# EAGLE board RFBoard (EAGLE 9.3.1), part 1 of 2
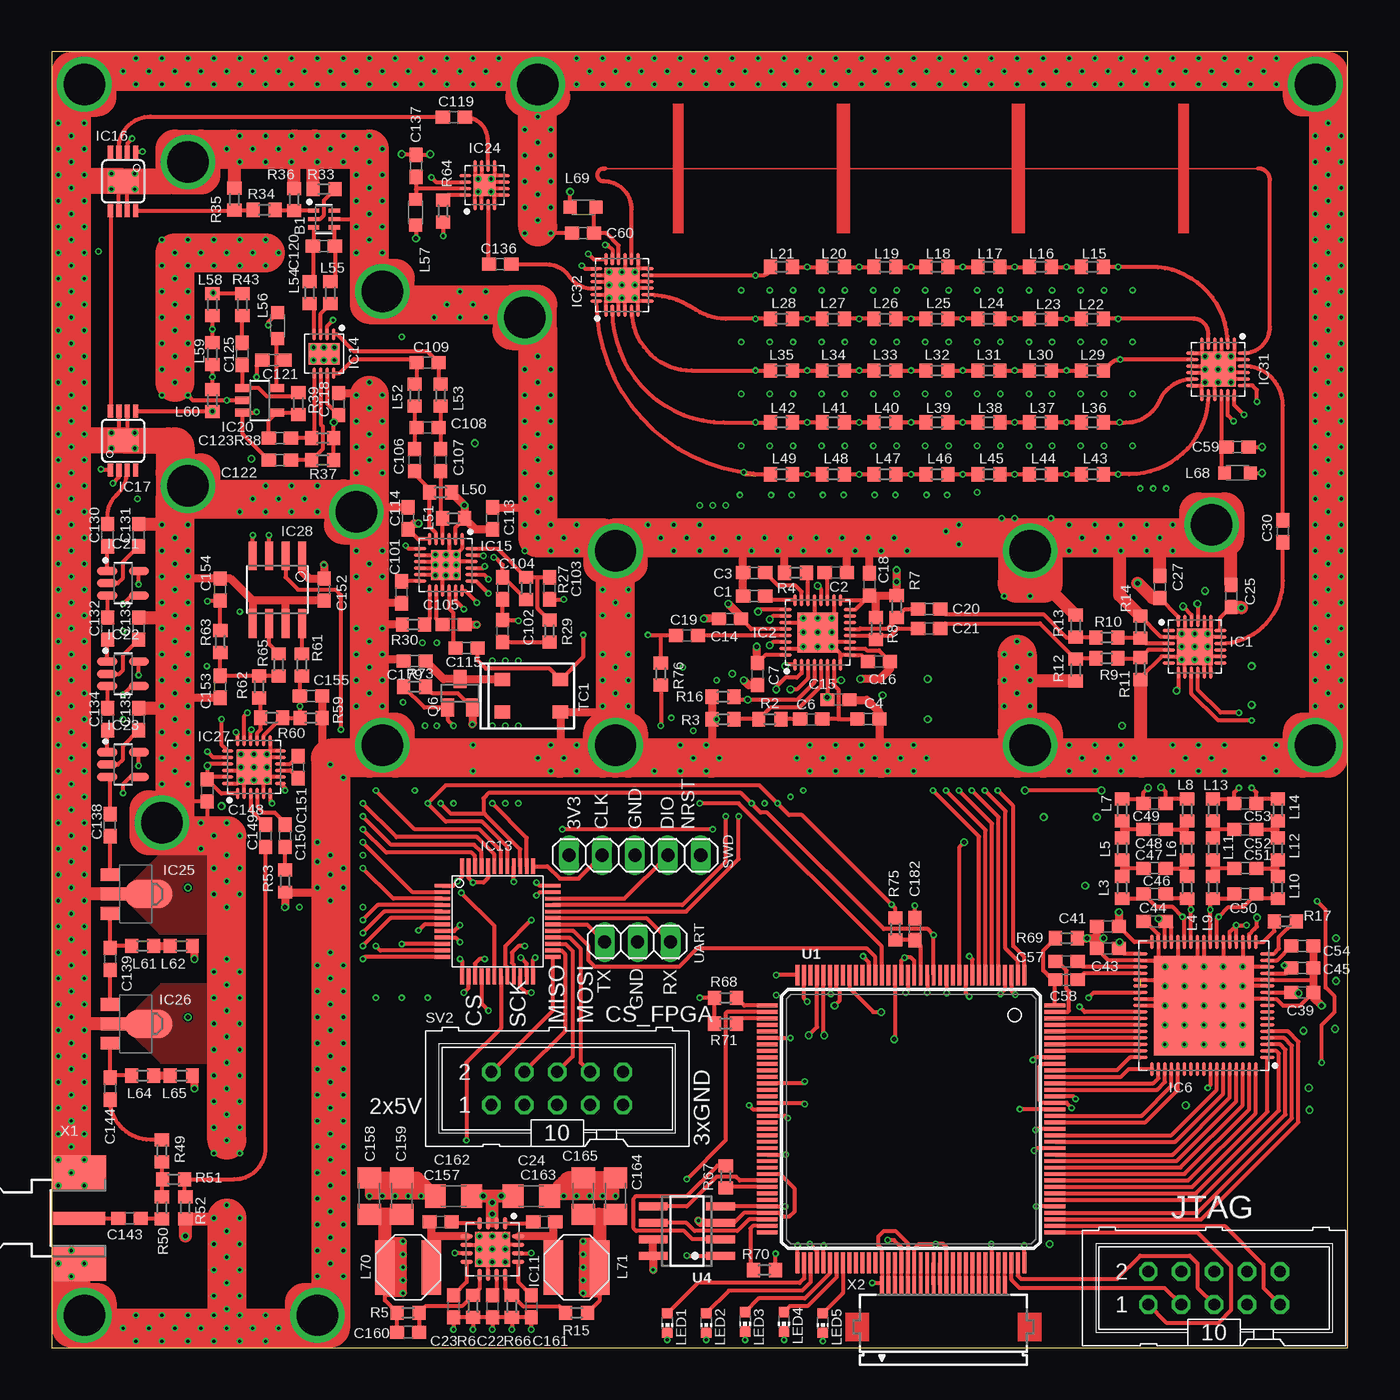
[diagram p8: board, top side]
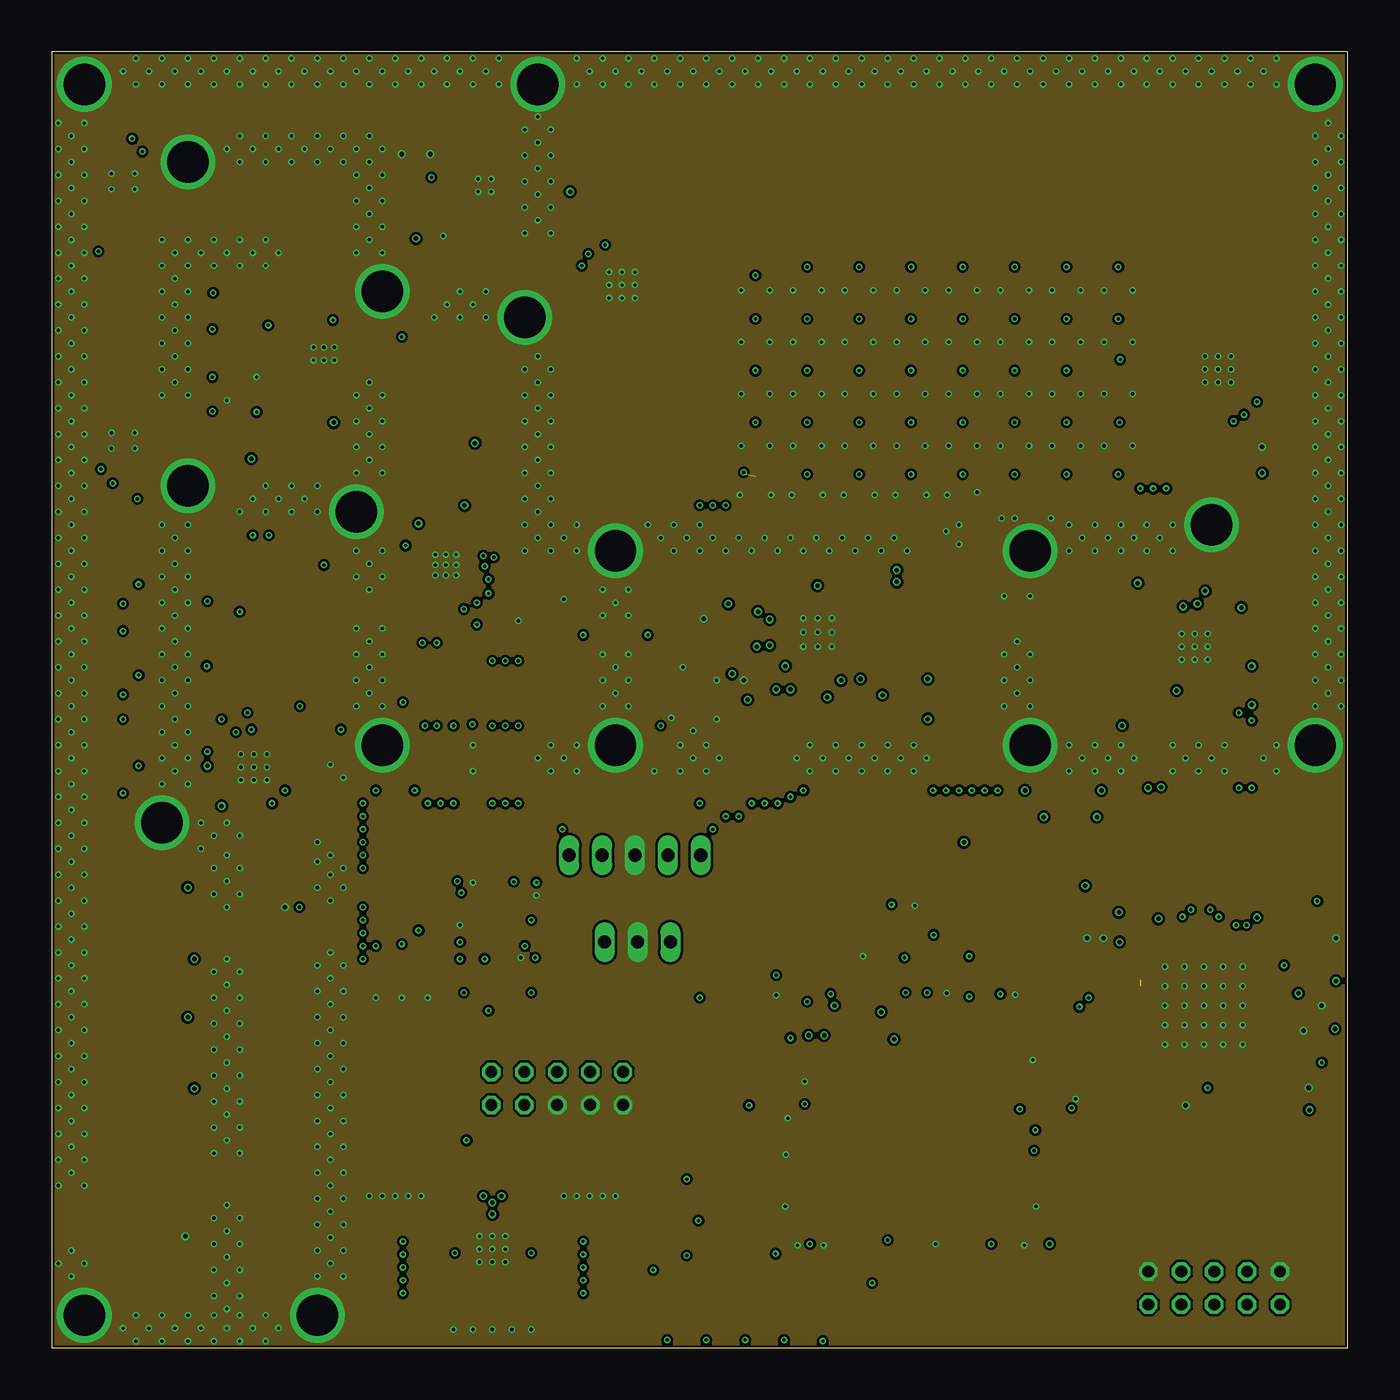
[diagram p9: board, inner layer Route2]
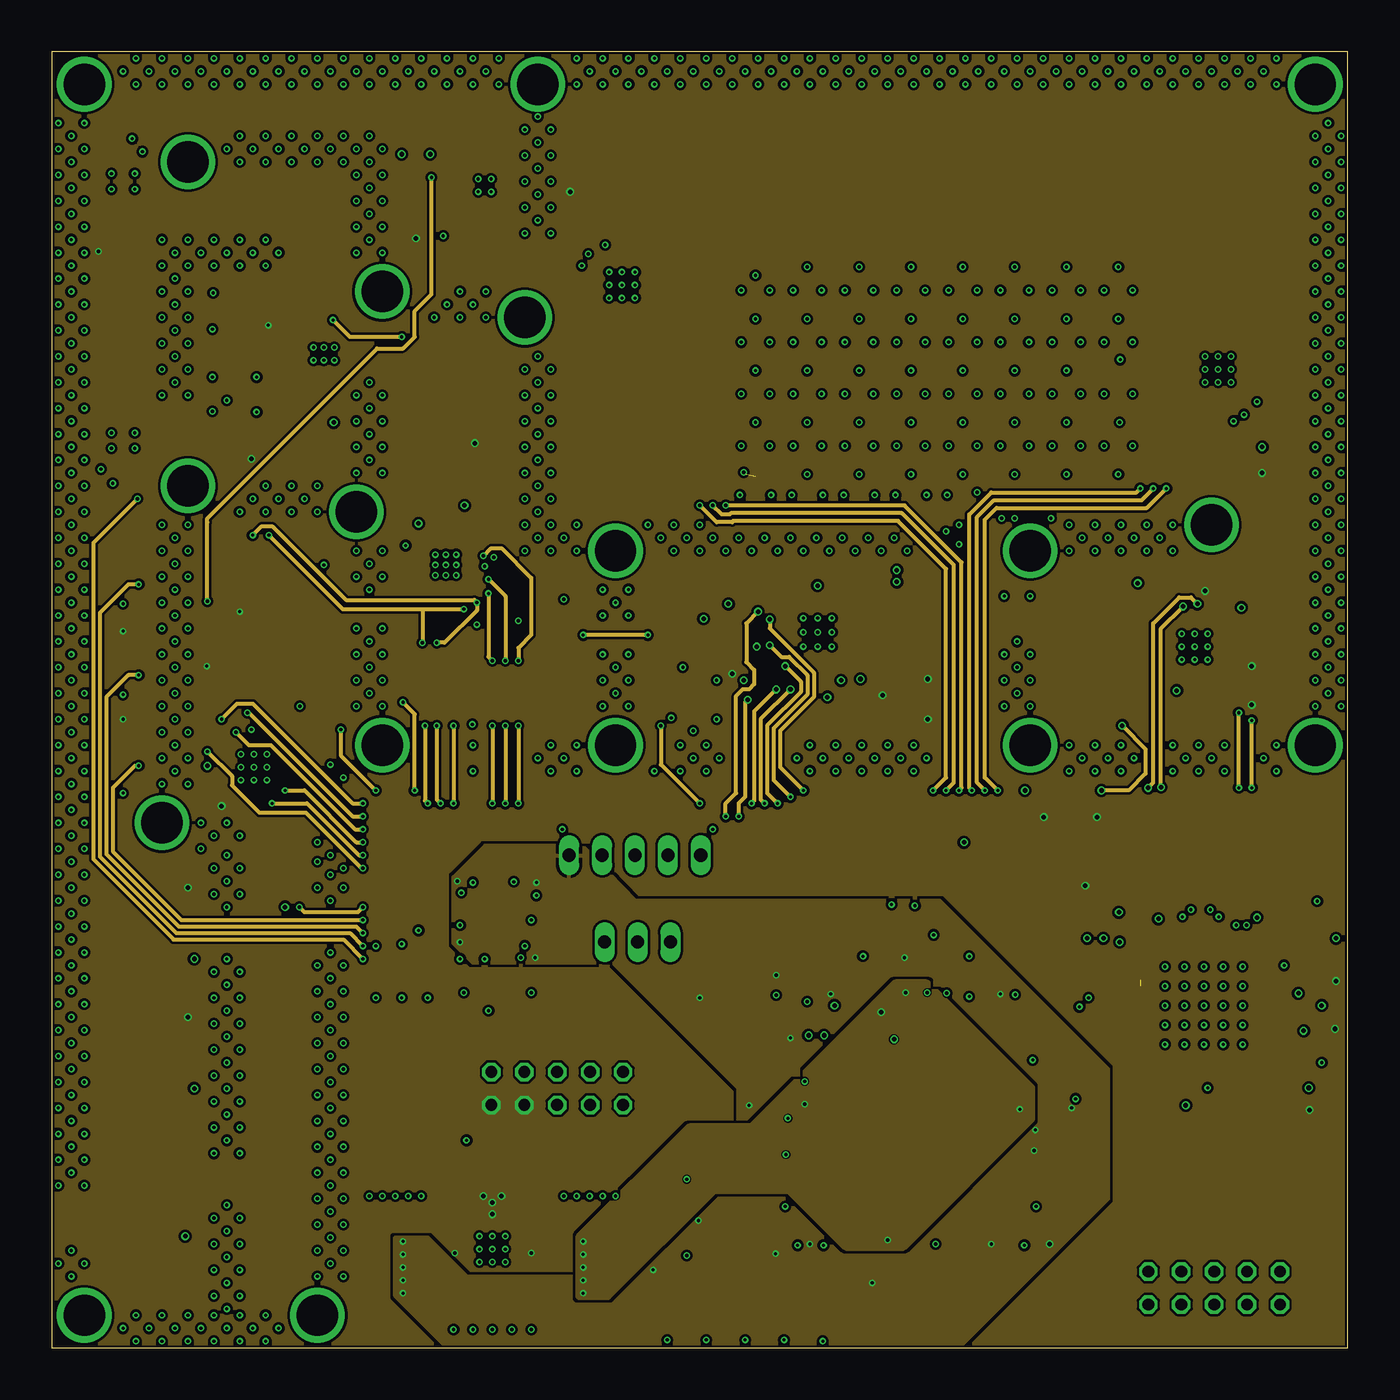
[diagram p10: board, inner layer Route15]
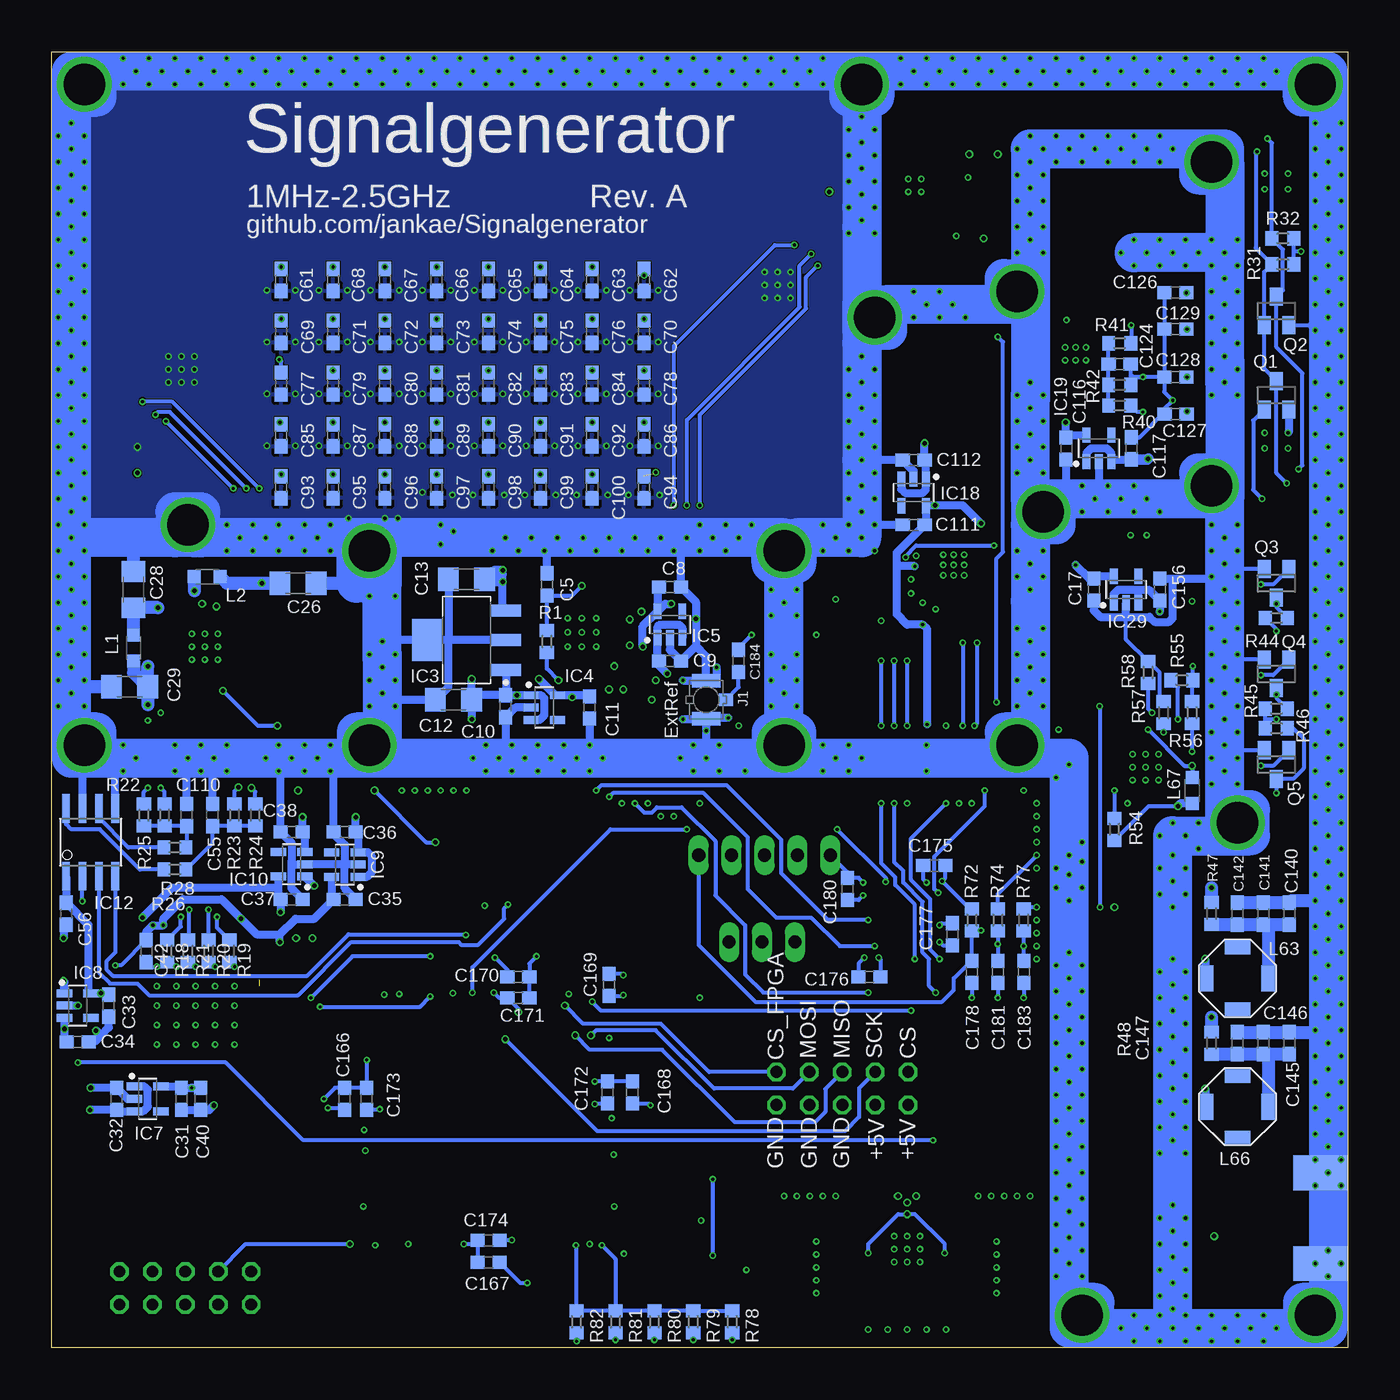
[diagram p11: board, bottom side, seen from below]

Size 100 x 100 mm. Coordinates in mm from the lower left corner, seen from the top.
Outline: 0,0 100,0 100,100 0,100 0,0
Copper layers (1+2*15+16): Top 0.035mm / dielectric 0.2mm / Route2 0.0175mm / dielectric 1.064mm / Route15 0.0175mm / dielectric 0.2mm / Bottom 0.035mm
Design rules "JLCPCB4L_7628 *": minimum track width 3.5mil, minimum drill 0.2mm, track to track 3.5mil, track to pad 3.5mil, pad to pad 3.5mil, via to via 3.5mil, smd to smd 0mil, copper to edge 0.2mm, drill to drill 0.2mm, minimum pad ring 10mil, minimum via ring 0.125mm, stop-mask expansion 4mil, vias tented up to drill 0mil, thermal gap 10mil

## Footprints (pad centres in the part's own frame; a part is rotated, then mirrored left to right if it is on the bottom)
INDCAF65P200X125X95-6 = smd 0.862 x 0.312: 1 -0.8,0.65; 2 -0.8,0; 3 -0.8,-0.65; 4 0.8,-0.65; 5 0.8,0; 6 0.8,0.65
C0603 = smd 1.1 x 1: 1 -0.85,0; 2 0.85,0
C1206 = smd 1.6 x 1.8: 1 -1.4,0; 2 1.4,0
QFN50P400X400X100-25T280 = smd 0.96 x 0.264: 1 -1.985,1.25; 2 -1.985,0.75; 3 -1.985,0.25; 4 -1.985,-0.25; 5 -1.985,-0.75; 6 -1.985,-1.25; 13 1.985,-1.25; 14 1.985,-0.75; 15 1.985,-0.25; 16 1.985,0.25; 17 1.985,0.75; 18 1.985,1.25 | smd 0.264 x 0.96: 7 -1.25,-1.985; 8 -0.75,-1.985; 9 -0.25,-1.985; 10 0.25,-1.985; 11 0.75,-1.985; 12 1.25,-1.985; 19 1.25,1.985; 20 0.75,1.985; 21 0.25,1.985; 22 -0.25,1.985; 23 -0.75,1.985; 24 -1.25,1.985 | smd 2.8 x 2.8: 25 0,0
QFN50P500X500X80-33T310 = smd 0.937 x 0.27: 1 -2.487,1.75; 2 -2.487,1.25; 3 -2.487,0.75; 4 -2.487,0.25; 5 -2.487,-0.25; 6 -2.487,-0.75; 7 -2.487,-1.25; 8 -2.487,-1.75; 17 2.487,-1.75; 18 2.487,-1.25; 19 2.487,-0.75; 20 2.487,-0.25; 21 2.487,0.25; 22 2.487,0.75; 23 2.487,1.25; 24 2.487,1.75 | smd 0.27 x 0.937: 9 -1.75,-2.487; 10 -1.25,-2.487; 11 -0.75,-2.487; 12 -0.25,-2.487; 13 0.25,-2.487; 14 0.75,-2.487; 15 1.25,-2.487; 16 1.75,-2.487; 25 1.75,2.487; 26 1.25,2.487; 27 0.75,2.487; 28 0.25,2.487; 29 -0.25,2.487; 30 -0.75,2.487; 31 -1.25,2.487; 32 -1.75,2.487 | smd 3.1 x 3.1: 33 0,0
SOT230P700X180-4 = smd 2.265 x 0.929: 1 -3.073,2.3; 2 -3.073,0; 3 -3.073,-2.3 | smd 2.265 x 3.229: 4 3.073,0
SOT95P240X110-5 = smd 1.18 x 0.609: 1 -1.024,0.95; 2 -1.024,0; 3 -1.024,-0.95; 4 1.024,-0.95; 5 1.024,0.95
QFN50P1000X1000X100-69T770 = smd 1.098 x 0.264: 1 -4.907,4; 2 -4.907,3.5; 3 -4.907,3; 4 -4.907,2.5; 5 -4.907,2; 6 -4.907,1.5; 7 -4.907,1; 8 -4.907,0.5; 9 -4.907,0; 10 -4.907,-0.5; 11 -4.907,-1; 12 -4.907,-1.5; 13 -4.907,-2; 14 -4.907,-2.5; 15 -4.907,-3; 16 -4.907,-3.5; 17 -4.907,-4; 35 4.907,-4; 36 4.907,-3.5; 37 4.907,-3; 38 4.907,-2.5; 39 4.907,-2; 40 4.907,-1.5; 41 4.907,-1; 42 4.907,-0.5; 43 4.907,0; 44 4.907,0.5; 45 4.907,1; 46 4.907,1.5; 47 4.907,2; 48 4.907,2.5; 49 4.907,3; 50 4.907,3.5; 51 4.907,4 | smd 0.264 x 1.098: 18 -4,-4.907; 19 -3.5,-4.907; 20 -3,-4.907; 21 -2.5,-4.907; 22 -2,-4.907; 23 -1.5,-4.907; 24 -1,-4.907; 25 -0.5,-4.907; 26 0,-4.907; 27 0.5,-4.907; 28 1,-4.907; 29 1.5,-4.907; 30 2,-4.907; 31 2.5,-4.907; 32 3,-4.907; 33 3.5,-4.907; 34 4,-4.907; 52 4,4.907; 53 3.5,4.907; 54 3,4.907; 55 2.5,4.907; 56 2,4.907; 57 1.5,4.907; 58 1,4.907; 59 0.5,4.907; 60 0,4.907; 61 -0.5,4.907; 62 -1,4.907; 63 -1.5,4.907; 64 -2,4.907; 65 -2.5,4.907; 66 -3,4.907; 67 -3.5,4.907; 68 -4,4.907 | smd 7.7 x 7.7: 69 0,0
QFN65P400X400X100-17T270 = smd 0.96 x 0.337: 1 -1.985,0.975; 2 -1.985,0.325; 3 -1.985,-0.325; 4 -1.985,-0.975; 9 1.985,-0.975; 10 1.985,-0.325; 11 1.985,0.325; 12 1.985,0.975 | smd 0.337 x 0.96: 5 -0.975,-1.985; 6 -0.325,-1.985; 7 0.325,-1.985; 8 0.975,-1.985; 13 0.975,1.985; 14 0.325,1.985; 15 -0.325,1.985; 16 -0.975,1.985 | smd 2.7 x 2.7: 17 0,0
SO08 = smd 0.61 x 2.21: 1 -1.905,-2.616; 2 -0.635,-2.616; 3 0.635,-2.616; 4 1.905,-2.616; 5 1.905,2.616; 6 0.635,2.616; 7 -0.635,2.616; 8 -1.905,2.616
LQFP48 = smd 0.3 x 1.2: 1 -2.75,-4.25; 2 -2.25,-4.25; 3 -1.75,-4.25; 4 -1.25,-4.25; 5 -0.75,-4.25; 6 -0.25,-4.25; 7 0.25,-4.25; 8 0.75,-4.25; 9 1.25,-4.25; 10 1.75,-4.25; 11 2.25,-4.25; 12 2.75,-4.25; 25 2.75,4.25; 26 2.25,4.25; 27 1.75,4.25; 28 1.25,4.25; 29 0.75,4.25; 30 0.25,4.25; 31 -0.25,4.25; 32 -0.75,4.25; 33 -1.25,4.25; 34 -1.75,4.25; 35 -2.25,4.25; 36 -2.75,4.25 | smd 1.2 x 0.3: 13 4.25,-2.75; 14 4.25,-2.25; 15 4.25,-1.75; 16 4.25,-1.25; 17 4.25,-0.75; 18 4.25,-0.25; 19 4.25,0.25; 20 4.25,0.75; 21 4.25,1.25; 22 4.25,1.75; 23 4.25,2.25; 24 4.25,2.75; 37 -4.25,2.75; 38 -4.25,2.25; 39 -4.25,1.75; 40 -4.25,1.25; 41 -4.25,0.75; 42 -4.25,0.25; 43 -4.25,-0.25; 44 -4.25,-0.75; 45 -4.25,-1.25; 46 -4.25,-1.75; 47 -4.25,-2.25; 48 -4.25,-2.75
SON50P300X300X80-9T165X238 = smd 0.917 x 0.27: 1 -1.497,0.75; 2 -1.497,0.25; 3 -1.497,-0.25; 4 -1.497,-0.75; 5 1.497,-0.75; 6 1.497,-0.25; 7 1.497,0.25; 8 1.497,0.75 | smd 1.65 x 2.38: 9 0,0
QFN50P400X400X80-25T230 = smd 0.96 x 0.27: 1 -1.985,1.25; 2 -1.985,0.75; 3 -1.985,0.25; 4 -1.985,-0.25; 5 -1.985,-0.75; 6 -1.985,-1.25; 13 1.985,-1.25; 14 1.985,-0.75; 15 1.985,-0.25; 16 1.985,0.25; 17 1.985,0.75; 18 1.985,1.25 | smd 0.27 x 0.96: 7 -1.25,-1.985; 8 -0.75,-1.985; 9 -0.25,-1.985; 10 0.25,-1.985; 11 0.75,-1.985; 12 1.25,-1.985; 19 1.25,1.985; 20 0.75,1.985; 21 0.25,1.985; 22 -0.25,1.985; 23 -0.75,1.985; 24 -1.25,1.985 | smd 2.3 x 2.3: 25 0,0
MSOP08 = smd 0.4 x 1: 1 -0.976,-2.263; 2 -0.326,-2.263; 3 0.324,-2.263; 4 0.974,-2.263; 5 0.974,2.262; 6 0.324,2.262; 7 -0.326,2.262; 8 -0.976,2.262 | smd 2.41 x 1.78: 9 0,0
SOT23-5 = smd 0.6 x 1.2: 1 -0.95,-1.306; 2 0,-1.306; 3 0.95,-1.306; 4 0.95,1.306; 5 -0.95,1.306
SOT95P280X110-5 = smd 1.562 x 0.649: 1 -1.225,0.95; 2 -1.225,0; 3 -1.225,-0.95; 4 1.225,-0.95; 5 1.225,0.95
QFN50P300X300X85-17T170 = smd 0.911 x 0.27: 1 -1.501,0.75; 2 -1.501,0.25; 3 -1.501,-0.25; 4 -1.501,-0.75; 9 1.501,-0.75; 10 1.501,-0.25; 11 1.501,0.25; 12 1.501,0.75 | smd 0.27 x 0.911: 5 -0.75,-1.501; 6 -0.25,-1.501; 7 0.25,-1.501; 8 0.75,-1.501; 13 0.75,1.501; 14 0.25,1.501; 15 -0.25,1.501; 16 -0.75,1.501 | smd 1.7 x 1.7: 17 0,0
SOT89 = smd 1 x 1.5: 1 -1.499,-1.981; 3 1.499,-1.981 | smd 1 x 2: 2 0,-1.727 | smd 2.2 x 3.7: 2@1 0,0.94
QFN50P400X400X100-25T270 = smd 0.86 x 0.27: 1 -2.035,1.25; 2 -2.035,0.75; 3 -2.035,0.25; 4 -2.035,-0.25; 5 -2.035,-0.75; 6 -2.035,-1.25; 13 2.035,-1.25; 14 2.035,-0.75; 15 2.035,-0.25; 16 2.035,0.25; 17 2.035,0.75; 18 2.035,1.25 | smd 0.27 x 0.86: 7 -1.25,-2.035; 8 -0.75,-2.035; 9 -0.25,-2.035; 10 0.25,-2.035; 11 0.75,-2.035; 12 1.25,-2.035; 19 1.25,2.035; 20 0.75,2.035; 21 0.25,2.035; 22 -0.25,2.035; 23 -0.75,2.035; 24 -1.25,2.035 | smd 2.7 x 2.7: 25 0,0
QFN50P400X400X75-25T270 = smd 0.96 x 0.27: 1 -1.985,1.25; 2 -1.985,0.75; 3 -1.985,0.25; 4 -1.985,-0.25; 5 -1.985,-0.75; 6 -1.985,-1.25; 13 1.985,-1.25; 14 1.985,-0.75; 15 1.985,-0.25; 16 1.985,0.25; 17 1.985,0.75; 18 1.985,1.25 | smd 0.27 x 0.96: 7 -1.25,-1.985; 8 -0.75,-1.985; 9 -0.25,-1.985; 10 0.25,-1.985; 11 0.75,-1.985; 12 1.25,-1.985; 19 1.25,1.985; 20 0.75,1.985; 21 0.25,1.985; 22 -0.25,1.985; 23 -0.75,1.985; 24 -1.25,1.985 | smd 2.7 x 2.7: 25 0,0
U.FL_SMT = smd 1.05 x 2.2: GND1 -1.475,0; GND2 1.475,0 | smd 1 x 1.05: SIG 0,-1.525
ML10 = drill 0.914 octagon: 1 -5.08,-1.27; 2 -5.08,1.27; 3 -2.54,-1.27; 4 -2.54,1.27; 5 0,-1.27; 6 0,1.27; 7 2.54,-1.27; 8 2.54,1.27; 9 5.08,-1.27; 10 5.08,1.27
L2012C = smd 1 x 1: 1 -1,0; 2 1,0
R0603 = smd 1 x 1.1: 1 -0.85,0; 2 0.85,0
SMD5018 = smd 1.1 x 2: P$1 -2.4,0; P$3 2.4,0 | smd 2 x 1.1: P$2 0,2.4; P$4 0,-2.4
SRN5040 = smd 1.5 x 4.2: P$1 -1.8,0; P$2 1.8,0
CHIP-LED0603 = smd 0.8 x 0.8: A 0,-0.75; C 0,0.75
SOT23 = smd 1 x 1.4: 1 -0.95,-1.1; 2 0.95,-1.1; 3 0,1.1
1X05 = drill 1.016 long: 1 -5.08,0; 2 -2.54,0; 3 0,0; 4 2.54,0; 5 5.08,0
5.0X3.2-TCXO = smd 1.2 x 1: 1 -2.25,-1.25; 2 2.25,-1.25; 3 2.25,1.25; 4 -2.25,1.25
TQ144 = smd 1.6 x 0.3: P1 -11.1,8.75; P2 -11.1,8.25; P3 -11.1,7.75; P4 -11.1,7.25; P5 -11.1,6.75; P6 -11.1,6.25; P7 -11.1,5.75; P8 -11.1,5.25; P9 -11.1,4.75; P10 -11.1,4.25; P11 -11.1,3.75; P12 -11.1,3.25; P13 -11.1,2.75; P14 -11.1,2.25; P15 -11.1,1.75; P16 -11.1,1.25; P17 -11.1,0.75; P18 -11.1,0.25; P19 -11.1,-0.25; P20 -11.1,-0.75; P21 -11.1,-1.25; P22 -11.1,-1.75; P23 -11.1,-2.25; P24 -11.1,-2.75; P25 -11.1,-3.25; P26 -11.1,-3.75; P27 -11.1,-4.25; P28 -11.1,-4.75; P29 -11.1,-5.25; P30 -11.1,-5.75; P31 -11.1,-6.25; P32 -11.1,-6.75; P33 -11.1,-7.25; P34 -11.1,-7.75; P35 -11.1,-8.25; P36 -11.1,-8.75; P73 11.1,-8.75; P74 11.1,-8.25; P75 11.1,-7.75; P76 11.1,-7.25; P77 11.1,-6.75; P78 11.1,-6.25; P79 11.1,-5.75; P80 11.1,-5.25; P81 11.1,-4.75; P82 11.1,-4.25; P83 11.1,-3.75; P84 11.1,-3.25; P85 11.1,-2.75; P86 11.1,-2.25; P87 11.1,-1.75; P88 11.1,-1.25; P89 11.1,-0.75; P90 11.1,-0.25; P91 11.1,0.25; P92 11.1,0.75; P93 11.1,1.25; P94 11.1,1.75; P95 11.1,2.25; P96 11.1,2.75; P97 11.1,3.25; P98 11.1,3.75; P99 11.1,4.25; P100 11.1,4.75; P101 11.1,5.25; P102 11.1,5.75; P103 11.1,6.25; P104 11.1,6.75; P105 11.1,7.25; P106 11.1,7.75; P107 11.1,8.25; P108 11.1,8.75 | smd 0.3 x 1.6: P37 -8.75,-11.1; P38 -8.25,-11.1; P39 -7.75,-11.1; P40 -7.25,-11.1; P41 -6.75,-11.1; P42 -6.25,-11.1; P43 -5.75,-11.1; P44 -5.25,-11.1; P45 -4.75,-11.1; P46 -4.25,-11.1; P47 -3.75,-11.1; P48 -3.25,-11.1; P49 -2.75,-11.1; P50 -2.25,-11.1; P51 -1.75,-11.1; P52 -1.25,-11.1; P53 -0.75,-11.1; P54 -0.25,-11.1; P55 0.25,-11.1; P56 0.75,-11.1; P57 1.25,-11.1; P58 1.75,-11.1; P59 2.25,-11.1; P60 2.75,-11.1; P61 3.25,-11.1; P62 3.75,-11.1; P63 4.25,-11.1; P64 4.75,-11.1; P65 5.25,-11.1; P66 5.75,-11.1; P67 6.25,-11.1; P68 6.75,-11.1; P69 7.25,-11.1; P70 7.75,-11.1; P71 8.25,-11.1; P72 8.75,-11.1; P109 8.75,11.1; P110 8.25,11.1; P111 7.75,11.1; P112 7.25,11.1; P113 6.75,11.1; P114 6.25,11.1; P115 5.75,11.1; P116 5.25,11.1; P117 4.75,11.1; P118 4.25,11.1; P119 3.75,11.1; P120 3.25,11.1; P121 2.75,11.1; P122 2.25,11.1; P123 1.75,11.1; P124 1.25,11.1; P125 0.75,11.1; P126 0.25,11.1; P127 -0.25,11.1; P128 -0.75,11.1; P129 -1.25,11.1; P130 -1.75,11.1; P131 -2.25,11.1; P132 -2.75,11.1; P133 -3.25,11.1; P134 -3.75,11.1; P135 -4.25,11.1; P136 -4.75,11.1; P137 -5.25,11.1; P138 -5.75,11.1; P139 -6.25,11.1; P140 -6.75,11.1; P141 -7.25,11.1; P142 -7.75,11.1; P143 -8.25,11.1; P144 -8.75,11.1
SO08' = smd 0.6 x 2.2: 1 -1.905,-2.6; 2 -0.635,-2.6; 3 0.635,-2.6; 4 1.905,-2.6; 5 1.905,2.6; 6 0.635,2.6; 7 -0.635,2.6; 8 -1.905,2.6
1X03 = drill 1.016 long: 1 -2.54,0; 2 0,0; 3 2.54,0
J502-ND-142-0711-821/826 = smd 4 x 1: 1 2.115,0 | smd 4.191 x 2.667: G@1 2.115,3.495; G@2 2.115,-3.495 | smd 4.191 x 2.667 bottom: G@3 2.115,3.495; G@4 2.115,-3.495
FH12-20S-0.5SH = smd 0.3 x 1.3: 1 -4.75,3.25; 2 -4.25,3.25; 3 -3.75,3.25; 4 -3.25,3.25; 5 -2.75,3.25; 6 -2.25,3.25; 7 -1.75,3.25; 8 -1.25,3.25; 9 -0.75,3.25; 10 -0.25,3.25; 11 0.25,3.25; 12 0.75,3.25; 13 1.25,3.25; 14 1.75,3.25; 15 2.25,3.25; 16 2.75,3.25; 17 3.25,3.25; 18 3.75,3.25; 19 4.25,3.25; 20 4.75,3.25

## Placement (x,y rotation side)
B1  HHM1522B1  [INDCAF65P200X125X95-6]  21,87.1 0 top
C1  1u  [C0603]  54.2,58 180 top
C2  1u  [C0603]  60.5,59.8 0 top
C3  1u  [C0603]  54.2,59.8 180 top
C4  2n  [C0603]  63.01,48.51 0 top
C5  180p  [C0603]  61.8,58.9 270 bottom
C6  33n  [C0603]  58.6,48.5 180 top
C7  100n  [C0603]  54.45,51.98 270 top
C8  1u  [C0603]  52.3,58.7 0 bottom
C9  1u  [C0603]  52.3,53 0 bottom
C10  1u  [C0603]  65,49.5 270 bottom
C11  1u  [C0603]  58.5,49.4 270 bottom
C12  10u  [C1206]  69,50 180 bottom
C13  10u  [C1206]  68,59.3 180 bottom
C14  100n  [C0603]  52.33,56.25 180 top
C15  100n  [C0603]  60.7,50 0 top
C16  100n  [C0603]  63.83,52.95 180 top
C17  1u  [C0603]  19.6,58.5 270 bottom
C18  100n  [C0603]  63.1,58.9 90 top
C19  100n  [C0603]  49.02,54.95 0 top
C20  10n  [C0603]  67.7,57 0 top
C21  10n  [C0603]  67.7,55.5 0 top
C22  1u  [C0603]  34,3.2 270 top
C23  10n  [C0603]  31,3.2 270 top
C24  10u  [C1206]  37,11.7 0 top
C25  1n  [C0603]  91,58 270 top
C26  10u  [C1206]  81,59 0 bottom
C27  1n  [C0603]  85.5,58.7 90 top
C28  10u  [C1206]  93.7,58.5 270 bottom
C29  10u  [C1206]  94,51 180 bottom
C30  10n  [C0603]  95,63 90 top
C31  1u  [C0603]  90,19.2 270 bottom
C32  1u  [C0603]  95,19.2 90 bottom
C33  1u  [C0603]  95.6,26.4 270 bottom
C34  1u  [C0603]  98,23.6 0 bottom
C35  1u  [C0603]  77.4,34.6 0 bottom
C36  1u  [C0603]  77.4,39.8 180 bottom
C37  1u  [C0603]  81.5,34.6 0 bottom
C38  1u  [C0603]  81.5,39.8 180 bottom
C39  100n  [C0603]  96.5,27.4 0 top
C40  100n  [C0603]  88.5,19.2 270 bottom
C41  100n  [C0603]  81.5,32.5 180 top
C42  100n  [C0603]  92.7,30.6 270 bottom
C43  100n  [C0603]  81.5,30.8 180 top
C44  100n  [C0603]  85.1,32.9 180 top
C45  100n  [C0603]  96.5,29.3 0 top
C46  15p  [C0603]  85.1,35 0 top
C47  68p  [C0603]  85.1,37 0 top
C48  68p  [C0603]  85.1,40 0 top
C49  15p  [C0603]  85.1,42 0 top
C50  15p  [C0603]  92.1,35 0 top
C51  68p  [C0603]  92.1,37 0 top
C52  68p  [C0603]  92.1,40 0 top
C53  15p  [C0603]  92.1,42 0 top
C54  1u  [C0603]  96.5,31 0 top
C55  10u  [C0603]  87.6,41.1 90 bottom
C56  1u  [C0603]  98.9,33.5 270 bottom
C57  100n  [C0603]  78.3,29.8 180 top
C58  100n  [C0603]  78.3,28.4 180 top
C59  100n  [C0603]  91.5,69.5 0 top
C60  100n  [C0603]  41,86 180 top
C61  20p  [C0603]  82.3,82.4 270 bottom
C62  20p  [C0603]  54.3,82.4 270 bottom
C63  30p  [C0603]  58.3,82.4 270 bottom
C64  30p  [C0603]  62.3,82.4 270 bottom
C65  30p  [C0603]  66.3,82.4 270 bottom
C66  30p  [C0603]  70.3,82.4 270 bottom
C67  30p  [C0603]  74.3,82.4 270 bottom
C68  30p  [C0603]  78.3,82.4 270 bottom
C69  14p  [C0603]  82.3,78.4 270 bottom
C70  14p  [C0603]  54.3,78.4 270 bottom
C71  20p  [C0603]  78.3,78.4 270 bottom
C72  20p  [C0603]  74.3,78.4 270 bottom
C73  20p  [C0603]  70.3,78.4 270 bottom
C74  20p  [C0603]  66.3,78.4 270 bottom
C75  20p  [C0603]  62.3,78.4 270 bottom
C76  20p  [C0603]  58.3,78.4 270 bottom
C77  9p  [C0603]  82.3,74.4 270 bottom
C78  9p  [C0603]  54.3,74.4 270 bottom
C79  14p  [C0603]  78.3,74.4 270 bottom
C80  14p  [C0603]  74.3,74.4 270 bottom
C81  14p  [C0603]  70.3,74.4 270 bottom
C82  14p  [C0603]  66.3,74.4 270 bottom
C83  14p  [C0603]  62.3,74.4 270 bottom
C84  14p  [C0603]  58.3,74.4 270 bottom
C85  5p6  [C0603]  82.3,70.4 270 bottom
C86  5p6  [C0603]  54.3,70.4 270 bottom
C87  9p  [C0603]  78.3,70.4 270 bottom
C88  9p  [C0603]  74.3,70.4 270 bottom
C89  9p  [C0603]  70.3,70.4 270 bottom
C90  9p  [C0603]  66.3,70.4 270 bottom
C91  9p  [C0603]  62.3,70.4 270 bottom
C92  9p  [C0603]  58.3,70.4 270 bottom
C93  3p9  [C0603]  82.3,66.4 270 bottom
C94  3p9  [C0603]  54.3,66.4 270 bottom
C95  5p6  [C0603]  78.3,66.4 270 bottom
C96  5p6  [C0603]  74.3,66.4 270 bottom
C97  5p6  [C0603]  70.3,66.4 270 bottom
C98  5p6  [C0603]  66.3,66.4 270 bottom
C99  5p6  [C0603]  62.3,66.4 270 bottom
C100  5p6  [C0603]  58.3,66.4 270 bottom
C101  10n  [C0603]  27,58.3 270 top
C102  10n  [C0603]  34.8,55.3 90 top
C103  330p  [C0603]  38.4,58.6 270 top
C104  220p  [C0603]  34.8,58.6 270 top
C105  10u  [C0603]  31,55.8 180 top
C106  5p6  [C0603]  28,68.5 90 top
C107  5p6  [C0603]  30,68.5 270 top
C108  DNP  [C0603]  29,71 0 top
C109  DNP  [C0603]  29,76 0 top
C110  10u  [C0603]  89.6,41.1 90 bottom
C111  1u  [C0603]  33.5,63.5 180 bottom
C112  1u  [C0603]  33.5,68.5 180 bottom
C113  100n  [C0603]  34,64 90 top
C114  100n  [C0603]  27.5,64 90 top
C115  100n  [C0603]  32,54 0 top
C116  1u  [C0603]  21.73,69.38 270 bottom
C117  1u  [C0603]  16.7,69.4 90 bottom
C118  100n  [C0603]  22.13,72.82 90 top
C119  10n  [C0603]  31.02,94.95 0 top
C120  DNP  [C0603]  21,85 180 top
C121  1u  [C0603]  17.1,76.2 180 top
C122  1u  [C0603]  17.6,68.5 180 top
C123  1u  [C0603]  17.6,70.2 0 top
C124  1u  [C0603]  17.6,75.9 180 bottom
C125  1u  [C0603]  14.7,76.7 270 top
C126  22p  [C0603]  13.3,81.4 0 bottom
C127  22p  [C0603]  13.28,72.03 0 bottom
C128  33p  [C0603]  13.3,74.9 0 bottom
C129  33p  [C0603]  13.3,78.6 0 bottom
C130  1u  [C0603]  4.3,62.7 90 top
C131  1u  [C0603]  6.7,62.7 90 top
C132  1u  [C0603]  4.3,55.5 90 top
C133  1u  [C0603]  6.7,55.5 90 top
C134  1u  [C0603]  4.3,48.5 90 top
C135  1u  [C0603]  6.7,48.5 90 top
C136  10n  [C0603]  34.6,83.6 0 top
C137  1u  [C0603]  28.1,91.2 90 top
C138  1u  [C0603]  4.49,40.32 90 top
C139  1u  [C0603]  4.5,30 90 top
C140  100p  [C0603]  4.5,33.5 90 bottom
C141  10n  [C0603]  6.5,33.5 90 bottom
C142  1u  [C0603]  8.5,33.5 90 bottom
C143  1u  [C0603]  6,10 180 top
C144  1u  [C0603]  4.5,20 90 top
C145  100p  [C0603]  4.5,23.5 90 bottom
C146  10n  [C0603]  6.5,23.5 90 bottom
C147  1u  [C0603]  8.5,23.5 90 bottom
C148  1u  [C0603]  12,43 270 top
C149  1u  [C0603]  16.5,39.5 90 top
C150  1u  [C0603]  18,39.5 90 top
C151  1n  [C0603]  19,44.8 270 top
C152  1u  [C0603]  21,58.5 270 top
C153  DNP  [C0603]  13,51 270 top
C154  DNP  [C0603]  13,58.5 90 top
C155  DNP  [C0603]  20,50.3 0 top
C156  1u  [C0603]  14.5,58.5 90 bottom
C157  100n  [C0603]  30,9.7 0 top
C158  22u  [C1206]  24.5,11.7 90 top
C159  22u  [C1206]  27,11.7 90 top
C160  22p  [C0603]  27.5,1.2 0 top
C161  10n  [C0603]  37,3.2 270 top
C162  10u  [C1206]  31,11.7 180 top
C163  100n  [C0603]  38,9.7 180 top
C164  22u  [C1206]  43.5,11.7 90 top
C165  22u  [C1206]  41,11.7 90 top
C166  100n  [C0603]  77.4,19.2 90 bottom
C167  100n  [C0603]  66.3,6.6 180 bottom
C168  100n  [C0603]  55.2,19.7 90 bottom
C169  100n  [C0603]  57,28 270 bottom
C170  100n  [C0603]  64,28.6 0 bottom
C171  100n  [C0603]  64,27 0 bottom
C172  100n  [C0603]  57.1,19.7 90 bottom
C173  100n  [C0603]  75.7,19.2 90 bottom
C174  100n  [C0603]  66.3,8.3 180 bottom
C175  100n  [C0603]  31.9,37.2 180 bottom
C176  100n  [C0603]  36.9,28.6 0 bottom
C177  100n  [C0603]  30.5,31.9 90 bottom
C178  100n  [C0603]  29,29 270 bottom
C179  100n  [C0603]  28,53 180 top
C180  100n  [C0603]  38.6,35.4 270 bottom
C181  100n  [C0603]  27,29 270 bottom
C182  33p  [C0603]  66.6,32.3 90 top
C183  100n  [C0603]  25,29 270 bottom
C184  100n  [C0603]  47,53 270 bottom
IC1  HMC1097  [QFN50P400X400X100-25T280]  88.2,54.1 0 top
IC2  MAX2871  [QFN50P500X500X80-33T310]  59.1,55.2 90 top
IC3  AP2114HA-3.3  [SOT230P700X180-4]  68,54.6 180 bottom
IC4  NCP702-3.3  [SOT95P240X110-5]  62,49.4 0 bottom
IC5  NCP702-3.3  [SOT95P240X110-5]  52.3,55.8 90 bottom
IC6  MAX5873  [QFN50P1000X1000X100-69T770]  88.9,26.4 180 top
IC7  NCP702-1.8  [SOT95P240X110-5]  92.6,19.2 0 bottom
IC8  NCP702-3.3  [SOT95P240X110-5]  98,26.4 0 bottom
IC9  NCP702-3.3  [SOT95P240X110-5]  77.39,37.28 180 bottom
IC10  NCP702-1.8  [SOT95P240X110-5]  81.5,37.3 180 bottom
IC11  TPS42951  [QFN65P400X400X100-17T270]  34,7.6 270 top
IC12  MCP4812  [SO08]  97,39 0 bottom
IC13  STM32F030C8T  [LQFP48]  34.4,32.9 270 top
IC14  LT5560  [SON50P300X300X80-9T165X238]  21,76.7 270 top
IC15  ADF4360  [QFN50P400X400X80-25T230]  30.4,60.4 270 top
IC16  HMC284  [MSOP08]  5.5,90 180 top
IC17  HMC284  [MSOP08]  5.5,70 0 top
IC18  NCP702-3.3  [SOT95P240X110-5]  33.5,66 270 bottom
IC19  NCP702-3.3  [SOT95P240X110-5]  19.2,69.4 90 bottom
IC20  LT1395  [SOT23-5]  16.04,73.1 270 top
IC21  MAADSS0008  [SOT95P280X110-5]  5.5,59 0 top
IC22  MAADSS0008  [SOT95P280X110-5]  5.5,52 0 top
IC23  MAADSS0008  [SOT95P280X110-5]  5.5,45 0 top
IC24  RFSA2033  [QFN50P300X300X85-17T170]  33.4,89.7 90 top
IC25  MMG3H21NT1  [SOT89]  6.5,35 270 top
IC26  MMG3H21NT1  [SOT89]  6.5,25 270 top
IC27  HMC1021  [QFN50P400X400X100-25T270]  15.6,44.8 90 top
IC28  MCP4812  [SO08]  17.4,58.5 180 top
IC29  NCP702-3.3  [SOT95P240X110-5]  17.1,58.5 90 bottom
IC31  QPC6064  [QFN50P400X400X75-25T270]  90,75.5 270 top
IC32  QPC6064  [QFN50P400X400X75-25T270]  44,82 90 top
J1  U.FL-R-SMT  [U.FL_SMT]  49.5,50 90 bottom
JTAG  [ML10]  89.7,4.6 0 top
L1  [L2012C]  93.7,54 90 bottom
L2  [L2012C]  88,59.5 0 bottom
L3  200n  [R0603]  82.6,35.5 90 top
L4  200n  [R0603]  87.6,35.5 90 top
L5  330n  [R0603]  82.6,38.5 90 top
L6  330n  [R0603]  87.6,38.5 90 top
L7  200n  [R0603]  82.6,41.5 90 top
L8  200n  [R0603]  87.6,41.5 90 top
L9  200n  [R0603]  89.6,35.5 90 top
L10  200n  [R0603]  94.6,35.5 90 top
L11  330n  [R0603]  89.6,38.5 90 top
L12  330n  [R0603]  94.6,38.5 90 top
L13  200n  [R0603]  89.6,41.5 90 top
L14  200n  [R0603]  94.6,41.5 90 top
L15  30n  [R0603]  80.3,83.4 0 top
L16  30n  [R0603]  76.3,83.4 0 top
L17  30n  [R0603]  72.3,83.4 0 top
L18  30n  [R0603]  68.3,83.4 0 top
L19  30n  [R0603]  64.3,83.4 0 top
L20  30n  [R0603]  60.3,83.4 0 top
L21  30n  [R0603]  56.3,83.4 0 top
L22  18  [R0603]  80.3,79.4 0 top
L23  18  [R0603]  76.3,79.4 0 top
L24  18  [R0603]  72.3,79.4 0 top
L25  18  [R0603]  68.3,79.4 0 top
L26  18  [R0603]  64.3,79.4 0 top
L27  18  [R0603]  60.3,79.4 0 top
L28  18  [R0603]  56.3,79.4 0 top
L29  12  [R0603]  80.3,75.4 0 top
L30  12  [R0603]  76.3,75.4 0 top
L31  12  [R0603]  72.3,75.4 0 top
L32  12  [R0603]  68.3,75.4 0 top
L33  12  [R0603]  64.3,75.4 0 top
L34  12  [R0603]  60.3,75.4 0 top
L35  12  [R0603]  56.3,75.4 0 top
L36  8n2  [R0603]  80.3,71.4 0 top
L37  8n7  [R0603]  76.3,71.4 0 top
L38  8n7  [R0603]  72.3,71.4 0 top
L39  8n7  [R0603]  68.3,71.4 0 top
L40  8n7  [R0603]  64.3,71.4 0 top
L41  8n7  [R0603]  60.3,71.4 0 top
L42  8n2  [R0603]  56.3,71.4 0 top
L43  5n6  [R0603]  80.3,67.4 0 top
L44  5n6  [R0603]  76.3,67.4 0 top
L45  5n6  [R0603]  72.3,67.4 0 top
L46  5n6  [R0603]  68.3,67.4 0 top
L47  5n6  [R0603]  64.3,67.4 0 top
L48  5n6  [R0603]  60.3,67.4 0 top
L49  5n6  [R0603]  56.3,67.4 0 top
L50  100n  [R0603]  30,66 180 top
L51  100n  [R0603]  31,64 180 top
L52  3n9  [R0603]  28,73.5 270 top
L53  3n9  [R0603]  30,73.5 270 top
L54  3n9  [R0603]  19.9,81.4 90 top
L55  3n9  [R0603]  21.5,81.4 90 top
L56  [L2012C]  17.42,78.87 90 top
L57  [L2012C]  28.08,87.61 270 top
L58  30n  [R0603]  12.4,80.5 90 top
L59  30n  [R0603]  12.4,76.7 90 top
L60  30n  [R0603]  12.4,73.1 90 top
L61  30n  [R0603]  7,31 180 top
L62  470n  [R0603]  10,31 180 top
L63  SRU5018-101  [SMD5018]  8.5,28.5 180 bottom
L64  30n  [R0603]  7,21 180 top
L65  470n  [R0603]  10,21 180 top
L66  SRU5018-101  [SMD5018]  8.5,18.6 180 bottom
L67  [L2012C]  12,43 270 bottom
L68  [L2012C]  91.5,67.5 180 top
L69  [L2012C]  41,88 0 top
L70  2u2  [SRN5040]  27.5,6.2 180 top
L71  2u2  [SRN5040]  40.5,6.2 0 top
LED1  [CHIP-LED0603]  47.5,1.9 180 top
LED2  [CHIP-LED0603]  50.5,1.9 180 top
LED3  [CHIP-LED0603]  53.5,2 180 top
LED4  [CHIP-LED0603]  56.5,2 180 top
LED5  [CHIP-LED0603]  59.5,1.9 180 top
Q1  BSS123  [SOT23]  5.5,73.5 0 bottom
Q2  BSS123  [SOT23]  5.5,80 0 bottom
Q3  BSS123  [SOT23]  5.5,59 180 bottom
Q4  BSS123  [SOT23]  5.5,52 180 bottom
Q5  BSS123  [SOT23]  5.5,45 180 bottom
Q6  BSS84  [SOT23]  31.5,50.5 0 top
R1  1k  [R0603]  61.8,54.5 90 bottom
R2  100  [R0603]  55.4,48.5 180 top
R3  120  [R0603]  51.8,48.5 180 top
R4  5k1  [R0603]  57.4,59.8 0 top
R5  73k2  [R0603]  27.5,2.7 0 top
R6  22k1  [R0603]  32.5,3.2 270 top
R7  49R9  [R0603]  65.2,57.2 90 top
R8  49R9  [R0603]  63.6,55.5 90 top
R9  0  [R0603]  81.4,53.2 0 top
R10  0  [R0603]  81.4,54.8 0 top
R11  DNP  [R0603]  84,52.4 90 top
R12  DNP  [R0603]  79,52.3 90 top
R13  DNP  [R0603]  79,55.7 90 top
R14  DNP  [R0603]  84,55.6 90 top
R15  15k  [R0603]  40.5,2.7 180 top
R16  10k  [R0603]  51.79,50.23 0 top
R17  1.91k  [R0603]  95.2,32.9 180 top
R18  49R9  [R0603]  91.1,30.6 270 bottom
R19  49R9  [R0603]  86.3,30.6 270 bottom
R20  49R9  [R0603]  87.9,30.6 270 bottom
R21  49R9  [R0603]  89.5,30.6 270 bottom
R22  49R9  [R0603]  91.3,41.1 270 bottom
R23  49R9  [R0603]  85.9,41.1 270 bottom
R24  49R9  [R0603]  84.3,41.1 270 bottom
R25  49R9  [R0603]  92.9,41.1 270 bottom
R26  470  [R0603]  90.5,36.9 0 bottom
R27  15k  [R0603]  36.6,58.6 270 top
R28  470  [R0603]  90.5,38.6 0 bottom
R29  6k8  [R0603]  38.4,55.3 270 top
R30  4k7  [R0603]  27.9,55.8 0 top
R31  10k  [R0603]  5,83.6 180 bottom
R32  10k  [R0603]  5,85.6 180 bottom
R33  3  [R0603]  21,89.4 180 top
R34  0  [R0603]  16.4,87.8 180 top
R35  DNP  [R0603]  14.09,88.62 90 top
R36  DNP  [R0603]  18.7,88.6 90 top
R37  200  [R0603]  20.9,68.5 0 top
R38  200  [R0603]  20.9,70.2 0 top
R39  200  [R0603]  19.03,72.87 270 top
R40  200  [R0603]  17.6,72.7 0 bottom
R41  4k7  [R0603]  17.6,77.5 0 bottom
R42  4k7  [R0603]  17.6,74.3 0 bottom
R43  49R9  [R0603]  14.7,80.5 90 top
R44  10k  [R0603]  5.5,56.3 0 bottom
R45  10k  [R0603]  5.5,49.3 0 bottom
R46  10k  [R0603]  5.5,47.8 0 bottom
R47  0  [R0603]  10.5,33.5 90 bottom
R48  0  [R0603]  10.5,23.5 90 bottom
R49  8R66  [R0603]  8.5,15.2 90 top
R50  8R66  [R0603]  8.5,10.8 90 top
R51  110  [R0603]  9.4,13 0 top
R52  77R5  [R0603]  10.3,10.8 270 top
R53  49R9  [R0603]  18,36 90 top
R54  10k  [R0603]  18,40 90 bottom
R55  10k  [R0603]  12.8,51.5 180 bottom
R56  10k  [R0603]  12,49 270 bottom
R57  10k  [R0603]  14.2,49 90 bottom
R58  10k  [R0603]  15.4,52.1 90 bottom
R59  DNP  [R0603]  20,48.6 0 top
R60  1u  [R0603]  16.97,48.61 0 top
R61  10k  [R0603]  19.3,52.7 90 top
R62  10k  [R0603]  16,51 90 top
R63  10k  [R0603]  13,54.5 90 top
R64  10k  [R0603]  30.2,87.7 90 top
R65  DNP  [R0603]  17.5,52.7 90 top
R66  11k  [R0603]  35.5,3.2 270 top
R67  22  [R0603]  52,13.2 270 top
R68  10k  [R0603]  52,27 180 top
R69  10k  [R0603]  78.3,31.6 180 top
R70  10k  [R0603]  55,6 0 top
R71  10k  [R0603]  52,25 180 top
R72  10k  [R0603]  29,33 90 bottom
R73  10k  [R0603]  28,51 0 top
R74  10k  [R0603]  27,33 270 bottom
R75  22  [R0603]  65.1,32.3 270 top
R76  22  [R0603]  47,52 270 top
R77  10k  [R0603]  25,33 270 bottom
R78  220  [R0603]  47.5,2 270 bottom
R79  220  [R0603]  50.5,2 270 bottom
R80  220  [R0603]  53.5,2 270 bottom
R81  220  [R0603]  56.5,2 270 bottom
R82  220  [R0603]  59.5,2 270 bottom
SV2  [ML10]  39,20 0 top
SWD  [1X05]  45,38 0 top
TC1  TCXO-NO-VC-CFPT-127  [5.0X3.2-TCXO]  37,50.3 0 top
U1  6SLX9TQG144  [TQ144]  66.3,17.65 270 top
U4  W25Q16BVSN  [SO08']  49,9 90 top
UART  [1X03]  45.2,31.3 180 top
X1  out  [J502-ND-142-0711-821/826]  0,10 0 top
X2  FH12-20S-0.5SH  [FH12-20S-0.5SH]  68.8,1.6 0 top

## Tracks (layer width: path | path; a pad name or v marks a point on that pad's centre or on a via)
10MHZ_REF  (via drill 0.25)
  Top 0.3: C19.1 46.9,54.95 | 46.9,54.95 46.05,54.95 v46,55 | v41,55 41,53.3 39.2,51.5 TC1.3 38.4,52.4 33.5,52.4 32.85,53.05 C115.2 | R76.1 47,54.85 46.9,54.95
  Route15 0.3: v46,55 v41,55
  Bottom 0.3: C184.1 47,54 v46,55
15DB1  (via drill 0.25)
  Top 0.3: v6.7,58.9 6.7,59.92 IC21.5 | IC13.6 26.15,33.15 v24,31
  Route15 0.3: v6.7,58.9 5.9,58.9 3.7,56.7 3.7,37.9 9.6,32 23,32 v24,31
  Bottom 0.3: Q3.1 5.75,58.9 v6.7,58.9
15DB2  (via drill 0.25)
  Top 0.3: v6.7,51.9 6.7,52.92 IC22.5 | IC13.5 25.65,33.65 v24,32
  Route15 0.3: v6.7,51.9 5.9,51.9 4.2,50.2 4.2,38.1 9.8,32.5 23.5,32.5 v24,32
  Bottom 0.3: Q4.1 5.75,51.9 v6.7,51.9
15DB3  (via drill 0.25)
  Top 0.3: v6.7,44.9 6.7,45.92 IC23.5 | IC13.4 25.15,34.15 v24,33
  Route15 0.3: v6.7,44.9 6.4,44.9 4.7,43.2 4.7,38.3 10,33 v24,33
  Bottom 0.3: Q5.1 5.75,44.9 v6.7,44.9
+3V3  (via drill 0.25, 0.35)
  Top 0.3: C160.1 R5.1 25.7,3.65 25.7,4.4 L70.P$2 | U4.3 51.63,9.6 52.6,9.6 53.4,10.4 U1.P69 56.1,10.4 56.4,10.1 56.9,10.1 57.3,10.5 57.3,12.3 56.2,13.4 U1.P63 | U1.P20 65.55,29.85 v65.8,30.1 66.3,30.1 66.55,29.85 U1.P18 | v78.7,18.5 78.3,18.9 U1.P129 76.4,18.9 76.2,19.1 76.2,21.7 76.4,21.9 U1.P135 | v53.8,18.7 54.1,18.4 U1.P53 | IC13.24 37.15,29.95 v37.3,30.1 | IC13.9 31.15,31.65 v31.5,31.3 | IC13.48 31.65,36.35 v31.3,36 30.95,35.65 IC13.1 | IC13.36 37.65,35.65 v37.4,35.9 | v50,27 R68.2 R71.2 | U1.P36 v55.9,28.75 | R70.2 v55.85,7.25 | U1.P125 76,16.9 v75.9,16.8 | U1.P122 76,15.4 v75.8,15.2 | U1.P4 73.55,27.65 v73.2,27.3 | U1.P31 60.05,27.35 v60.1,27.3 | U1.P42 v57,23.9 | 64.05,5 U1.P86 64.05,7.65 63.8,7.9 63.8,8.6 64.2,9 65.1,9 66.05,8.05 66.05,6.4 | 64.05,5 X2.1 | v63.3,5 64.05,5 | X2.5 66.05,6.4 | 66.05,6.4 U1.P90 | X2.18 U1.P103 72.55,7.95 v72.5,8 | U1.P76 59.05,7.45 v58.5,8
  Top 0.6: L70.P$2 v27.1,6.2 | v27.1,4.2 v27.1,5.2 v27.1,6.2 | v27.1,6.2 v27.1,7.2 v27.1,8.2 26.6,8.2 | 26.6,8.2 25.8,8.2 25.7,8.3 | 26.6,8.2 26.6,4.7 v27.1,4.2 | v27.1,4.2 25.9,4.2 25.7,4.4 | U4.7 U4.8 v46.4,6 | U4.3 50.06,9.63 v49.9,9.8
  Top 1: C159.1 25.7,10.3 | 25.7,10.3 C158.1 | L70.P$2 25.7,8.3 25.7,10.3
  Bottom 0.3: v65.8,30.1 64.85,29.15 C170.1 | v78.7,18.5 77.55,18.5 C166.1 | C168.1 53.95,18.85 v53.8,18.7 | v37.3,30.1 37.75,29.65 C176.1 | v31.5,31.3 31.25,31.05 C177.1 | C175.1 31.05,36.25 v31.3,36 29.15,33.85 R72.2 | v37.4,35.9 37.75,36.25 C180.1 38.6,36.68 SWD.1 | v55.9,28.75 56,28.85 C169.1 | JTAG.4 85.03,8 v77,8 | C167.1 63.85,5 v63.3,5
  pour Route15 (isolate 0.2, rank 3): 26.5,8.5 29,8.5 32,5.5 44.5,5.5 53,14 53,20 43.3,29.7 32.5,29.7 31,31.2 31,36.3 33.47,38.77 40.88,38.8 44.99,34.5 68.5,34.5 81.5,21.5 81.5,11.5 69.5,-0.5 31,-0.5 26.5,4
+5V  (via drill 0.25, 0.35)
  Top 0.3: L57.2 28.1,86.59 v28.1,85.6 | L56.2 16.7,79.15 v16.7,78.9 | L68.1 v93.4,67.5 | L69.1 v40,89.2 | 33.7,11.7 33.67,11.68 IC11.3 34,9.59 IC11.2 34.33,11.68 34.3,11.7 | IC11.7 31.12,7.28 v31.1,7.3 | IC11.14 36.98,7.28 v37,7.3
  Top 0.6: 34,9.59 v34,10.3 | v34,10.3 34,11.4 | 34,11.4 33.7,11.7 | 34,11.4 v34,10.3
  Top 1: C162.1 33.7,11.7 34.3,11.7 C24.1
  Bottom 0.3: R46.1 6.35,48.5 | 6.35,48.5 R45.1 | R44.1 5.5,55.45 v5.5,55.3 | 6.35,48.5 v5.5,48.5 | R31.1 4.15,84.6 | 4.15,84.6 R32.1 | 4.15,84.6 v3.6,84.6 | v16.7,78.9 16.7,77.55 R41.2 | R54.1 15.35,41.8 v13.1,41.8 | R56.1 12,51.45 R55.1 v11.95,52.6 | v31.1,7.3 31.1,8 33.4,10.3 v34,10.3 34.7,10.3 37,8 v37,7.3
  Bottom 0.6: C117.1 18.08,68.55 IC19.3 18.25,69.05 18.6,69.4 19.8,69.4 20.15,69.05 IC19.1 | L67.2 12.9,42 v13.1,41.8 | v14.5,56.8 C156.1 15.35,58.5 16.2,58.5 | IC29.1 18.05,58.15 17.7,58.5 16.2,58.5 | IC29.3 16.15,58.45 16.2,58.5 | IC18.3 34.45,66.25 34.15,65.95 32.8,65.95 32.55,66.2 IC18.1 32.55,68.4 C112.1 v32.65,69.8 | IC3.1 64.93,50.42 | 64.93,50.42 C10.1 v64.1,50.35 IC4.1 62.25,50.35 62,50.1 62,48.8 62.35,48.45 IC4.3 | C12.1 67.18,50.42 64.93,50.42 | IC5.3 51.35,55.55 51.6,55.8 53.1,55.8 53.25,55.65 IC5.1 53.25,53.1 C9.1 53.15,52.65 v52.5,52 | C12.1 v67.6,51.6 | C12.1 v67.6,48.5 | IC7.1 92.85,20.15 92.6,19.9 92.6,18.6 92.95,18.25 IC7.3 94.9,18.25 C32.1 v97.05,18.35 | IC8.3 v99.03,24.6 99.03,23.77 C34.1 | IC8.1 99.03,28.22 v99.1,28.3 | IC10.3 80.47,39.63 C38.1 v80.65,40.95 | IC9.1 75.67,36.33 75.3,36.7 75.3,37.9 75.63,38.23 IC9.3 76.36,39.62 C36.1 v76.55,40.95 | IC10.1 79.78,35.65 v79.75,35.65
  Bottom 0.8: C117.1 15.45,68.55 v15.4,68.6
  Bottom 1: R48.2 v10.5,25.5 | R47.2 v10.5,35.5 | L1.1 93.7,52.1 C29.1 | L2.1 v89,58.4 | C29.1 v92.6,52.6 | C29.1 v92.6,49.6
  other vias: 34,11.2 33.3,11.7 34.7,11.7
  pour Route15 (isolate 0.2, rank 6, no thermals): 100.5,100.5 100.5,-0.3 -0.3,-0.3 -0.5,-0.1 -0.5,100.5
/MOD_EN  (via drill 0.35)
  Top 0.3: IC1.7 86.95,50.85 v86.8,50.7 | v81,43 v75.1,43 | U1.P11 70.05,38.65 v70.4,39
  Route15 0.3: v82.6,48 84.4,46.2 84.4,45.4 84.4,44.3 83.1,43 v81,43
  Bottom 0.3: v86.8,50.7 84.1,48 v82.6,48 | v75.1,43 71.1,39 v70.4,39
ADF_CE  (via drill 0.25)
  Top 0.3: IC15.23 33.25,61.15 v33.3,61.1 | v33.4,30 33,30 32.65,29.65 IC13.15
  Route15 0.3: v33.3,61.1 33.9,61.7 34.7,61.7 37,59.4 37,55 36,54 v36,53 | v36,48 v36,42
  Bottom 0.3: v36,53 v36,48 | v36,42 36,37.4 34.9,36.3 34.9,35.7 33.4,34.2 v33.4,30
ADF_LE  (via drill 0.25)
  Top 0.3: IC15.19 32.75,59.15 v33.7,58.2 | IC13.38 36.65,39.35 v34,42
  Route15 0.3: v33.7,58.2 33.7,53.3 v34,53 | v34,48 v34,42
  Bottom 0.3: v34,53 v34,48
ADF_MUX  (via drill 0.25)
  Top 0.3: IC15.20 33.35,59.65 v33.7,59.3 | v31.8,27.4 32.15,27.75 IC13.14
  Route15 0.3: v33.7,59.3 35,58 v35,53 | v35,48 v35,42
  Bottom 0.3: v35,53 v35,48 | v31.8,27.4 32.3,27.9 32.3,30 32.8,30.5 32.8,34.4 34.3,35.9 34.3,36.8 35,37.5 v35,42
CLKN
  Top 0.3: C57.2 77.6,29.8 78.3,29.1 78.3,27.7 78.5,27.5 78.5,26 78.4,25.9 U1.P143
CLKP
  Top 0.3: U1.P144 77.4,28.35 C58.2 77.2,28.4 76.5,29.1 76.5,30.65 R69.2
CS
  Top 0.3: IC13.25 38.65,26 SV2.2
CS_FPGA  (via drill 0.35)
  Top 0.3: v60.4,26.4 60.8,26.8 60.8,27.5 60.55,27.75 U1.P30
  Bottom 0.3: SV2.10 49.27,21.27 53,25 59,25 v60.4,26.4
DAC_DIG3.2  (via drill 0.35)
  Top 0.3: IC14.7 21.25,72.85 C118.1 21.75,71.59 v21.75,71.4 R38.2 R37.2
  Bottom 0.6: IC19.5 21.54,70.42 C116.1 21.73,71.38 v21.75,71.4
DAC_DIG3.3  (via drill 0.35)
  Top 0.3: IC6.11 C39.1
  Top 0.6: C39.1 96.15,27.4 v96.2,27.35
  Bottom 0.6: IC12.1 C56.1 97.17,32.63 97.17,27.55 IC8.5 v96.2,27.35 95.7,27.35 C33.1
DBM_CS  (via drill 0.25)
  Top 0.3: IC28.2 18.04,59.47 19,58.5 21.9,58.5 22.3,58.1 v22.3,47.7 | IC13.42 34.65,38.35 33,40 28,40 v25,43
  Route15 0.3: v25,43 22.3,45.7 v22.3,47.7
DET_/EN  (via drill 0.25)
  Top 0.3: IC27.7 18,43.19 v18,43 | IC13.2 27.85,35.15 v24,39
  Route15 0.3: v18,43 19.5,43 23.5,39 v24,39
  Bottom 0.3: v18,43 R54.2
DET_SCI1  (via drill 0.25)
  Top 0.3: IC27.17 14.85,48.75 v15.1,49 | IC13.45 33.15,38.25 32.6,38.8 26.2,38.8 v24,41
  Route15 0.3: v15.1,49 15.2,49 23.2,41 v24,41
  Bottom 0.3: v15.1,49 15.4,49.3 R58.1
DET_SCI2  (via drill 0.25)
  Top 0.3: IC27.18 14.35,47.35 v14.2,47.5 | IC13.46 32.65,37.95 32.4,38.2 25.8,38.2 v24,40
  Route15 0.3: v14.2,47.5 15.2,46.5 16.9,46.5 23.4,40 v24,40
  Bottom 0.3: v14.2,47.5 R57.1
DET_SCI3  (via drill 0.25)
  Top 0.3: IC27.19 13.1,46.52 v13.1,48.5 | IC13.43 34.15,38.05 32.8,39.4 26.6,39.4 v24,42
  Route15 0.3: v13.1,48.5 14.3,49.7 15.5,49.7 23.2,42 v24,42
  Bottom 0.3: v13.1,48.5 13.1,50.95 R55.2
DET_SCI4  (via drill 0.25)
  Top 0.3: IC27.20 12.45,45.55 v12,46 | IC13.3 26.35,34.65 v24,37
  Route15 0.3: v12,46 13.9,44.1 13.9,43.4 16,41.3 19.6,41.3 23.9,37 v24,37
  Bottom 0.3: v12,46 R56.2
DORI  (via drill 0.25)
  Top 0.3: U1.P9 71.05,29.95 v70.8,30.2 | v80,27 80.4,27.4 IC6.41
  Bottom 0.3: v70.8,30.2 76.8,30.2 v80,27
EN_DIRECT  (via drill 0.25)
  Top 0.3: IC13.12 24.15,30.15 v24,30
  Route15 0.3: v6.6,65.5 3.2,62.1 3.2,37.7 9.4,31.5 22.5,31.5 v24,30
  Bottom 0.3: Q1.1 7.3,71.55 7.3,66.2 v6.6,65.5
EN_INTREF  (via drill 0.25)
  Top 0.3: R73.1 28.75,49.4 Q6.1 30.55,48.45 v31,48 | v31.5,30 31.65,29.85 IC13.13
  Route15 0.3: v31,48 v31,42
  Bottom 0.3: v31,42 33.7,39.3 33.7,36.1 32.2,34.6 32.2,30.7 v31.5,30
ETOUT  (via drill 0.25)
  Top 0.3: IC27.6 16.85,42.15 v17,42
  Route15 0.3: v17,42 19.7,42 23.7,38 v24,38
  Bottom 0.3: R74.1 27,35 v24,38
FILTERED
  Top 0.3: C136.2 38.2,83.6 arc-56 39.9,82.7 arc63 IC32.22
FLACH_MOSI
  Top 0.3: U1.P64 53.1,12.9 52.8,13.2 51.3,13.2 49,10.9 U4.5
FLASH_CLK
  Top 0.3: U1.P70 53.8,9.9 52.9,9 49.6,9 48.97,9.63 U4.6
FLASH_CS  (via drill 0.25)
  Top 0.3: U1.P38 52.1,25.9 52,25.8 52,16 v49,13 | v49,7.1 v49.01,7.09 U4.1
  Bottom 0.3: v49,13 v49,7.1
FLASH_MISO
  Top 0.3: U4.2 49.44,8.37 48.8,9 45.1,9 44.9,9.2 44.9,11.5 45.1,11.7 49,11.7 51.35,14.05 R67.1
FPGA_CS  (via drill 0.25)
  Top 0.3: IC13.16 33.15,26.55 v33.7,26 | v58.3,26.7 58.05,26.95 U1.P35
  Bottom 0.3: v33.7,26 57.6,26 v58.3,26.7
FULLBAND
  Top 0.3: C130.2 4.3,64.2 arc-47 5,65.8 arc48 IC17.3
GAIN_CTRL  (via drill 0.25)
  Top 0.3: R63.2 C154.1 12.95,57.6 v12,57.6 | v29.3,90.3 29.65,89.95 IC24.14
  Route15 0.3: v12,57.6 12,63.7 12,64 25.1,77.1 27.1,77.1 28,78 28,80 29.3,81.3 v29.3,90.3
GND  (via drill 0.25, 0.35, 3.2)  (1 unrouted)
  Top 0.3: IC16.6 5.18,89.68 IC16.9 5.83,89.67 IC16.7 | IC17.6 5.82,70.32 IC17.9 5.17,70.33 IC17.7 | v29.2,92.1 29.15,92.05 C137.2 27.05,92.05 v27,92.1 | IC24.12 32.65,90.45 33,90.1 | 33,90.1 IC24.17 | IC24.11 33.15,90.25 33,90.1 | IC24.9 34.15,90.45 | IC24.8 34.15,90.45 | 34.15,90.45 v33.9,90.2 | IC24.7 33.65,89.95 33.5,89.8 | 33.5,89.8 IC24.17 | IC24.6 33.85,89.45 | 33.85,89.45 33.65,89.65 | 33.65,89.65 33.5,89.8 | IC24.5 34.15,88.95 v33.9,89.2 | IC24.4 34.15,89.15 33.85,89.45 | IC24.2 33.15,89.15 33.65,89.65 | IC24.1 32.65,88.95 IC24.17 | R64.1 v30.2,85.8 | IC32.15 44.25,83 v44,83 | IC32.13 45.25,83.25 | IC32.12 45.25,83.25 | 45.25,83.25 v45,83 | IC32.9 45.25,81.75 v45,82 45.25,82.25 IC32.10 | IC32.7 45.25,80.75 | IC32.6 45.25,80.75 | 45.25,80.75 v45,81 | IC32.4 44.25,80.75 v44,81 43.75,80.75 IC32.3 | IC32.1 42.75,80.75 v43,81 42.75,81.25 IC32.23 | IC32.21 42.75,82.25 v43,82 | IC32.20 42.75,82.75 v43,83 | IC31.23 91.25,76.25 v91,76.5 91.25,76.75 IC31.1 | IC31.21 91.25,75.25 v91,75.5 | IC31.20 91.25,74.75 v91,74.5 | IC31.15 89.75,74.25 v90,74.5 | IC31.13 88.75,74.25 | IC31.12 88.75,74.25 | 88.75,74.25 v89,74.5 | IC31.10 88.75,75.25 v89,75.5 88.75,75.75 IC31.9 | IC31.7 88.75,76.75 | IC31.6 88.75,76.75 | 88.75,76.75 v89,76.5 | IC31.4 89.75,76.75 v90,76.5 90.25,76.75 IC31.3 | B1.5 24.4,87.1 24.5,87.2 | v9.5,74.5 10.9,73.1 v13.5,73.1 IC20.2 | C121.2 15.8,75.75 v15.8,74.9 | IC1.23 87.45,55.35 v87.2,55.1 86.95,54.85 IC1.2 85.6,54.85 R14.2 | IC1.8 87.45,52.85 v87.2,53.1 86.95,53.35 IC1.5 85.65,53.35 84,51.7 R11.1 | IC1.11 88.95,52.85 v89.2,53.1 | IC1.12 89.45,52.85 v89.2,53.1 | IC1.14 89.45,53.35 v89.2,53.1 | IC1.17 89.45,54.85 v89.2,55.1 | IC1.19 89.45,55.35 v89.2,55.1
  Top 0.3: IC1.20 88.95,55.35 v89.2,55.1 | C59.2 v93.4,69.5 | C60.2 38,86 37.5,86.5 | IC27.5 16.35,43.55 v16.6,43.8 16.85,44.05 IC27.8 | IC27.2 14.85,43.55 v14.6,43.8 14.35,43.55 IC27.24 | IC27.11 16.85,45.55 v16.6,45.8 16.85,46.05 | IC27.12 16.85,46.05 | IC27.13 16.85,46.05 | IC27.22 14.35,44.55 v14.6,44.8 | 9.5,41.5 10.15,42.15 C148.2 12,39.6 11.9,39.5 | IC15.3 30.65,61.45 v30.4,61.2 | IC15.8 29.55,61.15 v29.6,61.2 | IC15.9 29.35,60.65 v29.6,60.4 29.35,60.15 IC15.10 | IC15.11 29.65,59.65 IC15.25 30.65,60.65 | IC15.15 30.15,59.35 v30.4,59.6 | IC15.22 30.65,60.65 | IC15.1 31.65,61.65 30.65,60.65 | C104.2 C102.2 35.95,56.15 v36,56.1 | C103.2 v39.5,57.75 | IC2.27 58.35,55.95 IC2.33 | IC2.31 57.85,53.95 v58,54.1 | IC2.21 58.85,56.55 v59.1,56.3 | IC2.18 60.35,56.45 v60.2,56.3 | IC2.11 60.55,54.45 60.25,54.15 | 60.25,54.15 v60.2,54.1 | 60.85,53.55 60.95,53.45 IC2.9 62.48,53.45 C16.2 | IC2.8 60.85,53.55 | 60.85,53.55 60.25,54.15 | IC6.43 v85.9,26.4 85.4,26.9 IC6.42 | IC6.39 86,28.4 86.1,28.5 85.9,28.3 v85.9,27.9 | C43.2 81.55,29.9 IC6.36 85.4,29.9 | 85.4,29.9 85.8,29.5 | 85.8,29.5 v85.9,29.4 86.3,29.4 86.4,29.3 86.4,29.4 86.9,29.9 IC6.30 | 85.4,29.9 IC6.33 85.4,31.9 84.4,32.9 C44.2 | 85.4,29.9 85.8,29.5 | IC6.27 88.4,29 88.3,28.9 88.3,28.5 v88.9,27.9 | IC6.26 v88.9,29.4 | IC6.23 v90.4,29.4 | IC6.20 v91.9,29.4 IC6.15 | 92,28 92.4,28.4 IC6.13 97.35,28.4 | 92,28 v91.9,27.9 | IC6.12 92.1,27.9 92,28 | v91.9,26.4 92.4,26.9 IC6.10 94.5,26.9 95,26.4 96.35,26.4 C39.2 97.35,28.4 | C45.2 97.35,28.4 | IC11.6 33.67,7.92 IC11.17 | IC11.10 33.67,7.28 IC11.17 | IC11.15 34.33,7.92 IC11.17 | R66.2 C161.2 v37,1.4 | R66.2 C22.2 | C22.2 R6.2 | R6.2 C23.2 v31,1.4
  Top 0.3: C22.2 v34,1.4 | R6.2 v32.5,1.4 | R66.2 v35.5,1.4 | U4.4 U1.P68 v56.6,10.9 | U1.P25 63.05,29.75 v62.6,30.2 | v79,19.2 78.8,19.4 77.9,19.4 | 77.9,19.4 U1.P130 77.9,19.4 | U1.P136 75.9,22.4 v75.7,22.2 | U1.P54 56.6,17.9 v56.8,17.7 | v58.1,20.55 57.95,20.4 U1.P49 | U1.P77 v59.55,7.9 | U1.P73 v57.55,7.9 | U1.P108 v75.05,7.9 | U1.P113 v75.95,10.9 | U1.P60 v56.65,14.9 | U1.P13 v69.05,27.35 | IC13.23 36.65,29.65 v36.2,30.1 | IC13.8 31.05,32.15 v31.5,32.6 | IC13.47 32.15,36.25 v32.5,35.9 33.3,35.9 33.65,36.25 IC13.44 | IC13.35 37.65,35.15 v37.4,34.9 | C182.2 v66.6,34.1 | U1.P3 74.05,27.55 v74.35,27.25 | IC14.9 v21,76.2 | X2.6 U1.P91 66.55,7.65 66.9,8 v68.2,8 68.8,8 69.05,7.75 U1.P96 X2.11
  Top 0.6: C118.2 24.33,73.67 24.5,73.5 | C152.2 18,57.65 | 18,57.65 15.49,57.65 | 15.49,57.65 IC28.5 | IC28.7 18.04,57.62 18,57.65 | 24.45,57.65 24.5,57.7 24.75,57.45 C101.2 | 9.5,59.3 9.55,59.35 C154.2 13.79,59.35 15.49,57.65 | C153.2 10.25,50.15 9.5,49.4 | 24.4,50.3 24.5,50.2 | 23.4,48.6 24.5,47.5 | R30.1 24.5,55.8 | C114.2 25.15,64.85 24.5,65.5 | C113.2 37.45,64.85 37.5,64.9 | C155.2 R59.2 20.85,46.15 21.5,45.5 | R16.1 R3.2 50.95,45.55 50.9,45.5 | C2.2 61.35,62.45 61.3,62.5 | C18.2 63.1,62.5 | R4.1 56.55,62.45 56.5,62.5 | C1.2 C3.2 53.35,62.35 53.2,62.5 | C7.2 53.77,51.13 v53.4,51.5 | C15.2 62.9,50 63.86,49.04 C4.2 63.86,45.64 64,45.5 | C14.2 v50.3,56.25 | C54.2 C45.2 C39.2 97.35,27.05 v98,26.4 | C43.2 80.65,31.5 | 80.65,31.5 C41.2 | R69.1 v79.9,31.6 80.55,31.6 | 80.65,31.5 80.55,31.6 | 80.55,31.6 v81.15,31.6 | C24.2 v39.5,11.7 v40.5,11.7 v41.5,11.7 v42.5,11.7 v43.5,11.7 43.5,12.2 | 43.5,12.2 C164.2 43.17,12.78 39.48,12.78 | 43.5,12.2 39.3,12.2 39.1,12.4 | C162.2 v24.5,11.7 24.5,12.2 | 24.5,12.2 24.5,12.5 | 24.5,12.5 C158.2 | 24.5,12.2 29.1,12.2 | 28.6,12.7 24.7,12.7 24.5,12.5 | 39.2,45.5 39.25,45.55 TC1.2 43.45,49.05 43.5,49.1 | C179.2 27.05,53.1 24.5,53.1 | 21.5,35.1 21.45,35.15 R53.1 v18,34
  Top 1: IC26.2 1.5,25 | v10.3,8.6 R52.2 13.45,9.95 13.5,10 | C135.2 9.45,49.35 9.5,49.4 | C133.2 9.45,56.35 9.5,56.4 | C131.2 9.45,63.55 9.5,63.6 | R33.2 20.15,92.35 20.3,92.5 | R36.2 18.7,92.5 | R35.2 14.09,92.41 14,92.5 | C25.1 91,64 90.5,64.5 | C27.2 85.5,61.8 85.4,61.9 85.4,62.5 | R13.2 75.6,59.95 | 75.6,59.95 75.6,60 | R14.2 82.4,58.05 82.4,62.5 | v75.5,61.5 75.5,60.05 75.6,59.95 | R12.1 74.55,51.45 74.5,51.4 | R11.1 84,45.6 84.1,45.5 | C164.2 C165.2 39.8,13.1 39.48,12.78 39.1,12.4 C24.2 | C158.2 C159.2 28.2,13.1 28.6,12.7 29.1,12.2 C162.2 | IC25.2 1.5,35 | v1.5,13.5 v1.5,13.49 X1.G@3 2.12,14.12 v2.5,14.5 | X1.G@4 v2.5,6.5
  Top 2: 1.5,70 IC17.9 9,70 9.5,69.5 | 1.5,90.1 1.6,90 IC16.9 9,90 9.5,90.5
  Top 3: v13.5,16 13.5,39.5 11.9,39.5 9.5,39.5 | 9.5,39.5 9.5,41.5 | 9.5,41.5 9.5,49.4 9.5,56.4 9.5,59.3 9.5,63.6 9.5,65.5 | 9.5,69.5 9.5,67.5 | 9.5,67.5 9.5,65.5 | 9.5,65.5 11.5,65.5 | 11.5,65.5 22.5,65.5 | 22.5,65.5 24.5,65.5 | 24.5,73.5 24.5,65.5 | 3.5,98.5 1.5,98.5 1.5,96.5 | 3.5,98.5 36.5,98.5 | 36.5,98.5 37.5,98.5 | 38.5,98.5 96.5,98.5 | 96.5,98.5 98.5,98.5 98.5,96.5 | 98.5,96.5 98.5,47.5 | 98.5,47.5 98.5,45.5 96.5,45.5 | 96.5,45.5 84.1,45.5 76.5,45.5 | 76.5,45.5 74.5,45.5 | 74.5,45.5 64,45.5 50.9,45.5 44.5,45.5 | 44.5,45.5 43.5,45.5 | 43.5,45.5 42.5,45.5 | 42.5,45.5 39.2,45.5 26.5,45.5 | 26.5,45.5 24.5,45.5 | 24.5,45.5 21.5,45.5 21.5,35.1 21.5,3.5 | 21.5,3.5 21.5,1.5 19.5,1.5 | 19.5,1.5 v13.5,1.5 | v13.5,1.5 3.5,1.5 | 3.5,1.5 1.5,1.5 1.5,3.5 | 1.5,3.5 1.5,6 | 1.5,96.5 1.5,90.1 1.5,70 1.5,35 1.5,25 1.5,14 | 13.5,10 v13.5,1.5 | 24.5,65.5 24.5,63.5 | 24.5,63.5 24.5,57.7 24.5,55.8 24.5,53.1 24.5,50.2 24.5,47.5 | 24.5,47.5 24.5,45.5 | 43.5,45.5 v43.5,46.5 43.5,49.1 v43.5,61.5 43.5,62.5 44.5,62.5 | 44.5,62.5 53.2,62.5 56.5,62.5 61.3,62.5 63.1,62.5 74.5,62.5 | 74.5,62.5 76.5,62.5 | 76.5,62.5 82.4,62.5 85.4,62.5 88.5,62.5 | 88.5,62.5 90.5,62.5 90.5,64.5 88.5,64.5 88.5,62.5 | 74.5,53.5 74.5,51.4 74.5,47.5 | 74.5,47.5 74.5,45.5 | 74.5,62.5 74.5,59 76.5,59 76.5,62.5 | 96.5,45.5 96.5,47.5 98.5,47.5 | 74.5,47.5 76.5,47.5 76.5,45.5 | 42.5,45.5 42.5,47.5 44.5,47.5 44.5,45.5 | 1.5,3.5 3.5,3.5 3.5,1.5 | 19.5,1.5 19.5,3.5 21.5,3.5 | 9.5,39.5 7.5,39.5 7.5,41.5 9.5,41.5 | 9.5,67.5 11.5,67.5 11.5,65.5 | 22.5,65.5 22.5,63.5 24.5,63.5 | 1.5,96.5 3.5,96.5 3.5,98.5 | 11.5,92.5 11.5,90.5 9.5,90.5 9.5,92.5 14,92.5 18.7,92.5 20.3,92.5 24.5,92.5 24.5,87.2 24.5,82.5
  Top 3: 24.5,82.5 24.5,80.5 26.5,80.5 | 26.5,80.5 26.5,82.5 24.5,82.5 | 24.5,82.5 v25.5,81.5 26.5,80.5 | 26.5,80.5 35.5,80.5 | 35.5,80.5 37.5,80.5 37.5,78.5 | 35.5,80.5 35.5,78.5 37.5,78.5 | 37.5,78.5 37.5,64.9 v37.5,62.5 42.5,62.5 42.5,60.5 44.5,60.5 44.5,62.5 | 98.5,96.5 96.5,96.5 96.5,98.5 | 36.5,98.5 36.5,96.5 38.5,96.5 38.5,98.5 | 38.5,98.5 37.5,98.5 | 37.5,98.5 v37.5,97.5 37.5,86.5 | 24.5,47.5 26.5,47.5 26.5,45.5 | v9.5,74.5 v9.5,84.5 16.5,84.5
  Bottom 0.3: Q5.2 9.5,46.1 | Q3.2 9.5,60.1 | Q4.2 9.5,53.1 | Q2.2 1.5,78.9 | 4.55,70.65 v4.6,70.6 | R42.2 16.75,74.9 | 16.75,74.9 16.75,75.1 | 16.75,75.1 C124.1 | C128.1 v15.8,74.9 | v15.8,74.9 16.75,74.9 | C128.1 C129.1 C126.1 | C128.1 14.15,73.75 v13.5,73.1 14.13,72.47 14.13,72.2 | 16.75,75.1 16.55,74.9 v15.8,74.9 | C127.1 14.13,72.2 | C117.2 16.08,70.25 14.13,72.2 | R57.2 14.5,50.15 14.5,52.1 15.35,52.95 R58.2 17.1,54.65 17.1,56.4 | R19.2 86.25,29.75 v85.9,29.4 | R20.2 87.75,29.75 v87.4,29.4 | R21.2 89.25,29.75 v88.9,29.4 | R18.2 90.75,29.75 v90.4,29.4 | C42.2 92.35,29.4 v91.9,29.4 | C171.2 63.15,28.3 | 63.15,28.3 C170.2 | v62.6,30.2 63.15,29.65 63.15,28.3 | v79,19.2 78.15,20.05 C166.2 C173.2 v75.7,22.2 | C167.2 C174.2 67.45,8 v68.2,8 | C168.2 C172.2 v58.1,20.55 | v36.2,30.1 36.05,29.95 C176.2 | v31.5,32.6 31.35,32.75 C177.2 | v32.5,35.9 32.75,36.15 C175.2 | v37.4,34.9 37.75,34.55 C180.2 | C181.2 v27,27 | C178.2 v29,27 | C169.2 55.95,27.15 v55.9,27.2 | C183.2 v25,27 | v59.55,7.9 59.5,7.85 R82.1 R81.1 | R79.1 50.4,2.75 | R78.1 47.6,2.75 47.7,2.85 R79.1 | R79.1 R80.1 R81.1 | v57.55,7.9 56.5,6.85 R81.1
  Bottom 0.6: IC19.2 19.2,65.6 19.3,65.5 | C116.2 21.73,66.27 22.5,65.5 | C156.2 13.5,59.35 | 13.5,59.35 10.25,59.35 9.5,60.1 | C17.2 19.6,56.9 19.1,56.4 17.1,56.4 | 17.1,56.4 IC29.2 | 17.1,56.4 15.3,56.4 14.9,56 13.8,56 13.5,56.3 13.5,59.35 | v37.5,68.5 C112.2 33.5,67.65 IC18.2 | C111.2 v36.5,63.5 v37.5,62.5 | IC3.2 69.5,54.6 | 69.5,54.6 IC3.4 73.4,54.6 74.5,53.5 | C13.2 69.4,54.7 | 69.4,54.7 69.5,54.6 | 69.4,54.7 69.4,51 C12.2 74.3,50 74.5,50.2 | IC4.2 64.25,49.4 C10.2 65,45.7 65.2,45.5 | C11.2 58.5,45.7 58.7,45.5 | C5.1 61.8,62.4 61.9,62.5 | IC5.2 52.3,53.85 C9.2 50.3,54.15 | 50.3,54.15 v50.3,56.25 50.3,57.55 C8.2 51.45,62.45 51.5,62.5 | C110.2 89.6,45.5 | C55.2 87.6,45.4 87.7,45.5 | IC12.7 97.64,44.63 98.5,45.5 | IC12.5 95.09,45.3 94.9,45.5 | IC7.2 94.15,19.2 C32.2 v97,20.05 | C31.2 C40.2 87.85,18.35 v87.5,18.7 | C34.2 96.7,23.6 96.2,24.1 | C33.2 95.6,24.7 96.2,24.1 | IC8.2 v98,26.4 | 96.2,24.1 96.55,24.45 v96.6,24.45 | C56.2 99.1,32.45 v99.1,31.6 | IC9.2 77.4,37.28 | 77.4,37.28 80.46,37.28 IC10.2 81.3,37.3 81.5,37.5 | 77.4,37.28 77.4,38.8 78.25,39.65 C36.2 78.25,45.45 78.3,45.5 | 81.5,37.5 81.5,38.95 C38.2 82.35,45.25 82.1,45.5 | C35.2 77.4,35.45 77.4,37.28 | C37.2 81.5,35.45 81.5,37.5 | Q1.2 4.55,70.65 | 49.4,45.5 49.5,45.6 J1.GND1 49.42,48.6 | J1.GND2 49.5,53.35 50.3,54.15 | v47.8,48.6 49.42,48.6 | v51.3,48.5 49.52,48.5 49.42,48.6 | v51.3,51.5 49.52,51.5 J1.GND2 | v48.7,52.5 48.7,51.5 48.73,51.48 J1.GND2
  Bottom 1: C142.2 C141.2 C140.2 4.35,34.5 1.5,34.5 | C147.2 C146.2 C145.2 1.65,24.35 1.5,24.5 | C29.2 98.5,51 | C28.1 93.7,62.1 90.9,62.1 90.5,62.5 | C26.2 76.5,59 75.5,60 v75.5,61.5 | X1.G@4 v2.5,6.5 | X1.G@3 2.5,13.11 v2.5,12.5
  Bottom 3: v89.5,63.5 90.5,62.5 | v13.5,16 13.5,19 | 13.5,19 13.5,39.5 9.5,39.5 | 9.5,39.5 9.5,41.5 | 9.5,41.5 9.5,46.1 9.5,53.1 9.5,60.1 9.5,65.5 | 9.5,67.2 9.5,67.5 11.5,67.5 11.5,65.5 | 9.5,67.2 9.5,65.5 | 9.5,65.5 11.5,65.5 | 11.5,65.5 19.3,65.5 22.5,65.5 | 22.5,65.5 24.5,65.5 | 24.5,65.5 24.5,73 | 24.5,73 24.5,73.5 | 3.5,98.5 1.5,98.5 1.5,96.5 | 3.5,98.5 36.5,98.5 | 36.5,98.5 37.5,98.5 | 38.5,98.5 96.5,98.5 | 96.5,98.5 98.5,98.5 98.5,96.5 | 98.5,96.5 v98.5,62.5 | v98.5,62.5 98.5,51 98.5,47.5 | 98.5,47.5 98.5,45.5 96.5,45.5 | 96.5,45.5 94.9,45.5 89.6,45.5 87.7,45.5 82.1,45.5 78.3,45.5 76.5,45.5 | 76.5,45.5 74.5,45.5 | 74.5,45.5 65.2,45.5 58.7,45.5 49.4,45.5 44.5,45.5 | 44.5,45.5 43.5,45.5 | 43.5,45.5 42.5,45.5 | 42.5,45.5 26.5,45.5 | 26.5,45.5 24.5,45.5 | 24.5,45.5 21.5,45.5 21.5,3.5 | 21.5,3.5 21.5,1.5 19.5,1.5 | 19.5,1.5 v13.5,1.5 | v13.5,1.5 3.5,1.5 | 3.5,1.5 1.5,1.5 1.5,3.5 | 1.5,96.5 1.5,78.9 1.5,34.5 1.5,24.5 1.5,3.5 | v13.5,1.5 v13.5,9 | v13.5,9 13.5,10 | 24.5,65.5 24.5,63.5 | 24.5,63.5 24.5,57.6 24.5,47.5 | 24.5,47.5 24.5,45.5 | 43.5,45.5 43.5,62.5 44.5,62.5 | 44.5,62.5 51.5,62.5 61.9,62.5 74.5,62.5 | 74.5,62.5 76.5,62.5 | 76.5,62.5 88.5,62.5 | 88.5,62.5 89,62.5 | 89,62.5 90.5,62.5 | 74.5,53.5 74.5,53 | 74.5,53 74.5,50.2 74.5,47.5 | 74.5,47.5 74.5,45.5 | 74.5,62.5 74.5,59.5 | 74.5,59.5 74.5,59 76.5,59 76.5,62.5 | 90.5,62.5 90.5,64.5 88.5,64.5 88.5,62.5 | 96.5,45.5 96.5,47.5 98.5,47.5 | 74.5,47.5 76.5,47.5 76.5,45.5 | 42.5,45.5 42.5,47.5 44.5,47.5 44.5,45.5 | 1.5,3.5 3.5,3.5 3.5,1.5 | 19.5,1.5 19.5,3.5 21.5,3.5 | 9.5,39.5 7.5,39.5 7.5,41.5 9.5,41.5 | 22.5,65.5 22.5,63.5 24.5,63.5 | 1.5,96.5 3.5,96.5 3.5,98.5 | 11.5,90.5 9.5,90.5 9.5,91.5 | 9.5,91.5 9.5,92.5
  Bottom 3: 9.5,92.5 11.5,92.5 | 11.5,92.5 24.5,92.5 24.5,82.5 | 24.5,82.5 24.5,81.5 | 24.5,81.5 24.5,80.5 26.5,80.5 | 26.5,80.5 26.5,82.5 24.5,82.5 | 24.5,82.5 26.5,80.5 | 26.5,80.5 35.5,80.5 | 35.5,80.5 37.5,80.5 37.5,78.5 | 35.5,80.5 35.5,78.5 37.5,78.5 | 37.5,78.5 37.5,77.5 | 37.5,77.5 v37.5,68.5 v37.5,62.5 42.5,62.5 42.5,60.5 44.5,60.5 44.5,62.5 | 98.5,96.5 96.5,96.5 96.5,98.5 | 36.5,98.5 36.5,96.5 38.5,96.5 38.5,98.5 | 38.5,98.5 37.5,98.5 | 37.5,98.5 37.5,88 | 37.5,88 37.5,86.5 | 24.5,47.5 26.5,47.5 26.5,45.5 | 9.5,92.5 11.5,90.5 | 11.5,90.5 11.5,92.5 | v9.5,74.5 9.5,76.3 | 9.5,76.3 9.5,84 | 9.5,84 v9.5,84.5 16.5,84.5 | 9.5,76.3 9.5,67.2 | 24.5,81.5 24.5,73 | 9.5,91.5 9.5,84 | 37.5,88 37.5,77.5 | 89,62.5 v98.5,62.5 | 74.5,53 74.5,59.5 | v13.5,9 13.5,19